# Altium project BCM_ECU.PrjPcb (part 2 of 3)

## Sheet MOSFET_BANK.SchDoc
size C; SheetNumber: 2; SheetTotal: 15
Used 4 times, as channels MOSFET_BANK_0, MOSFET_BANK_1, MOSFET_BANK_2, MOSFET_BANK_3. Parts and nets are listed once, with the designators drawn on the sheet.
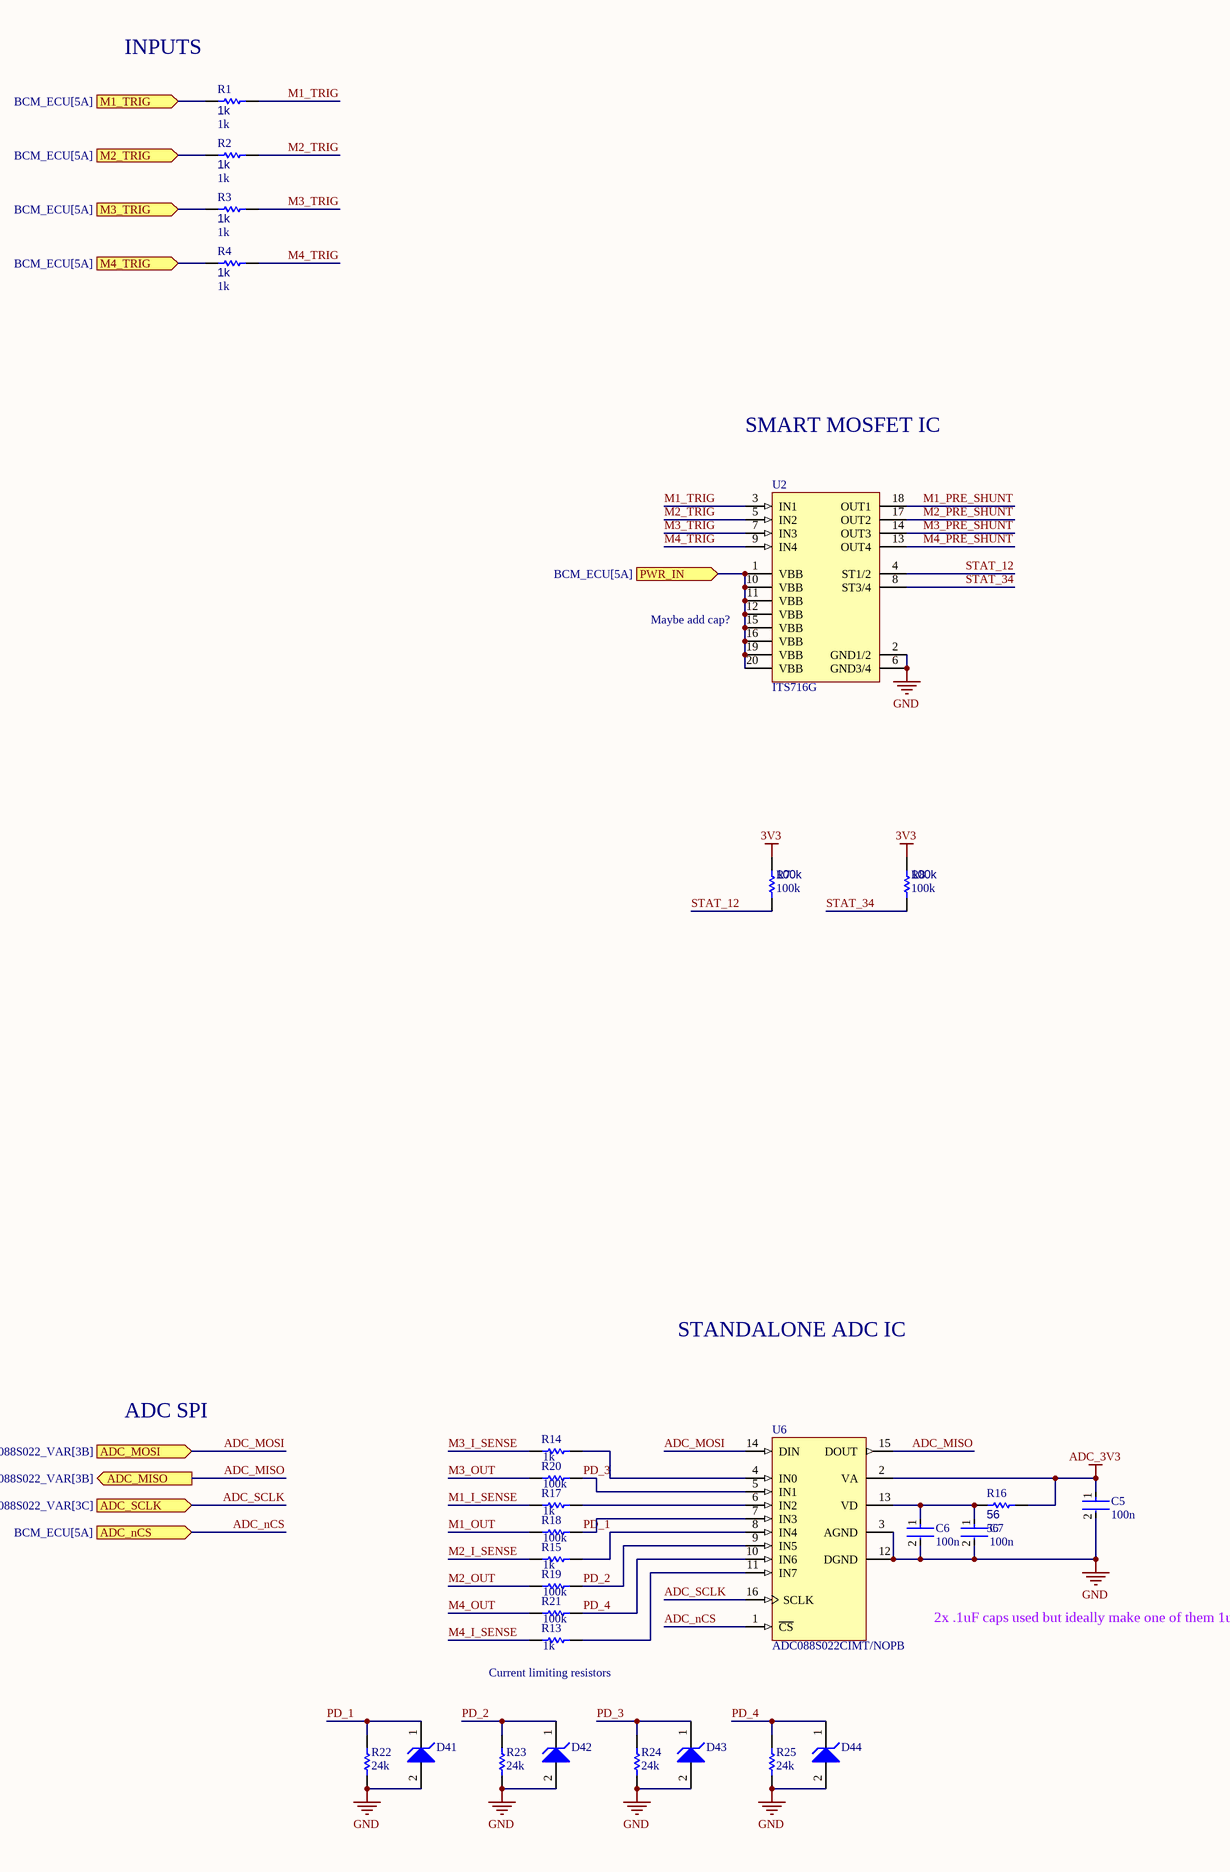
[diagram p7: MOSFET_BANK.SchDoc, left]
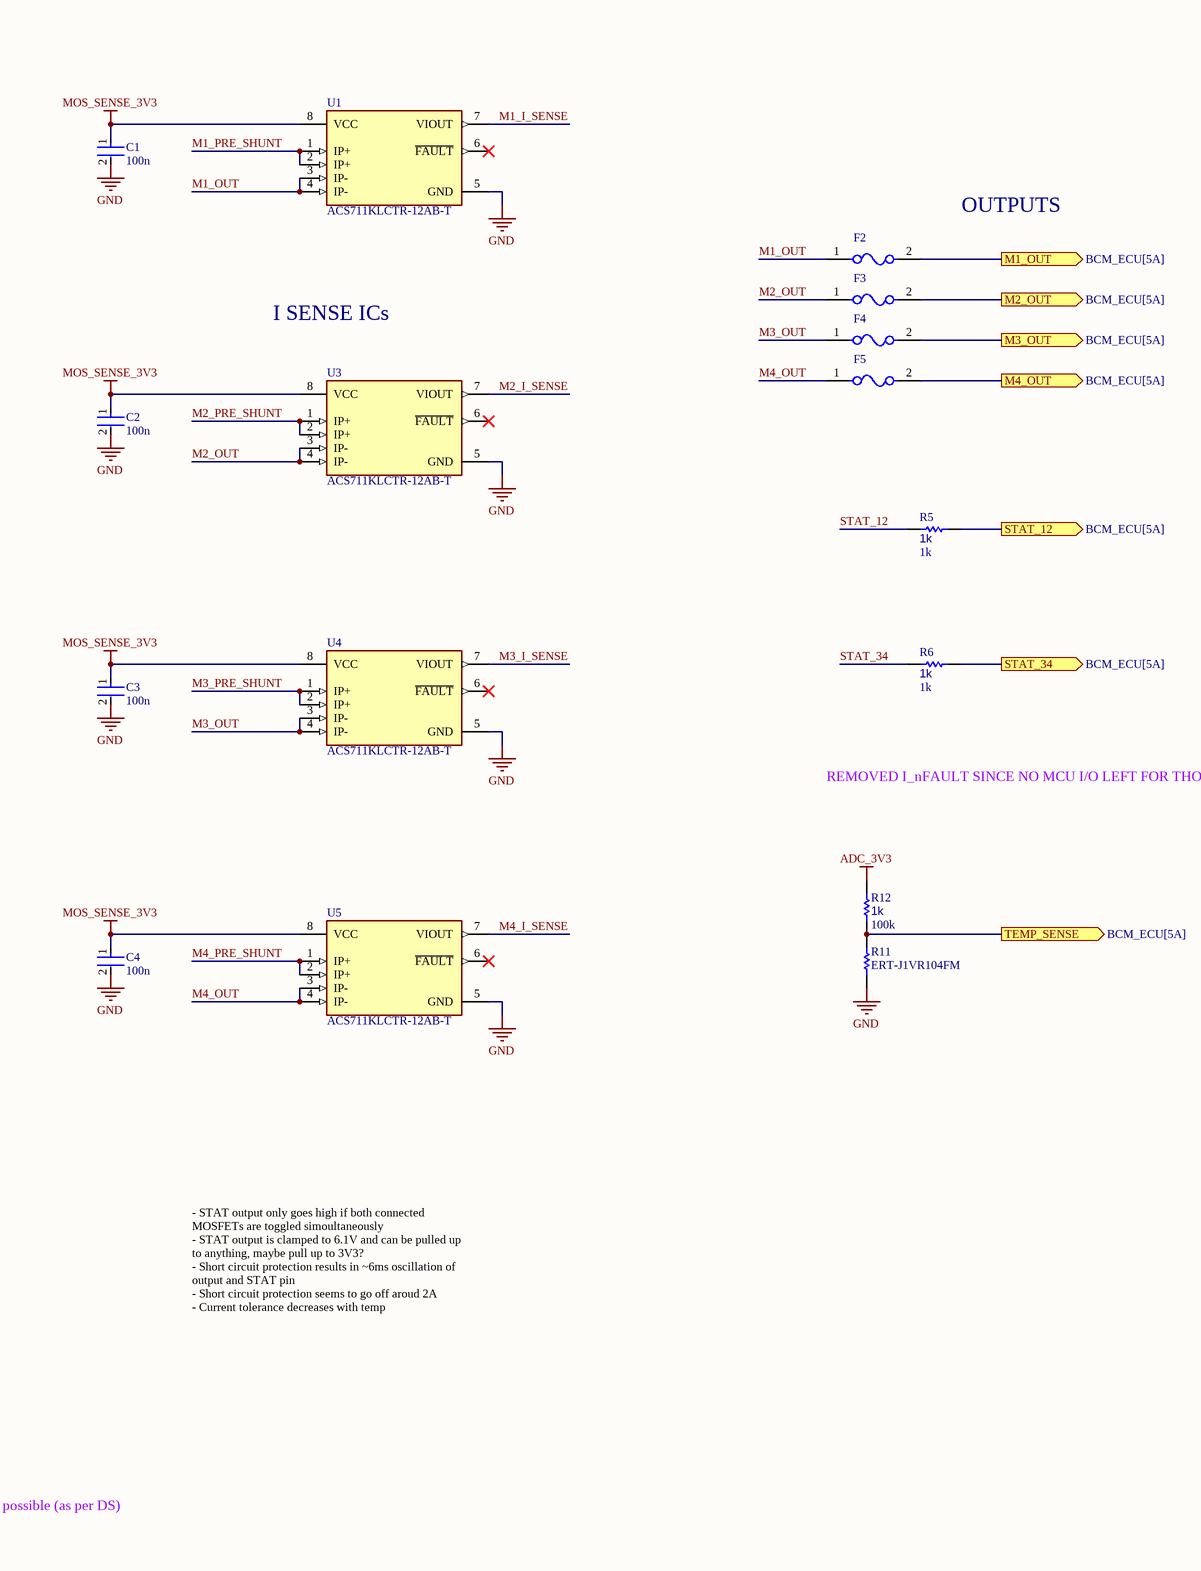
[diagram p8: MOSFET_BANK.SchDoc, right]

### Parts
C1  100n  [FP-0402-L_1_0_0_05-W_0_5-IPC_A]
C2  100n  [FP-0402-L_1_0_0_05-W_0_5-IPC_A]
C3  100n  [FP-0402-L_1_0_0_05-W_0_5-IPC_A]
C4  100n  [FP-0402-L_1_0_0_05-W_0_5-IPC_A]
C5  100n  [FP-0402-L_1_0_0_05-W_0_5-IPC_A]
C6  100n  [FP-0402-L_1_0_0_05-W_0_5-IPC_A]
C7  100n  [FP-0402-L_1_0_0_05-W_0_5-IPC_A]
D41  MM5Z3V3T1G  [ONSC-SOD-523-2-502-01_V]  (value not drawn)
D42  MM5Z3V3T1G  [ONSC-SOD-523-2-502-01_V]  (value not drawn)
D43  MM5Z3V3T1G  [ONSC-SOD-523-2-502-01_V]  (value not drawn)
D44  MM5Z3V3T1G  [ONSC-SOD-523-2-502-01_V]  (value not drawn)
F2  0466003.NR  [FP-0466-MFG]  (value not drawn)
F3  0466003.NR  [FP-0466-MFG]  (value not drawn)
F4  0466003.NR  [FP-0466-MFG]  (value not drawn)
F5  0466003.NR  [FP-0466-MFG]  (value not drawn)
R1  1k  [R0603B]
R2  1k  [R0603B]
R3  1k  [R0603B]
R4  1k  [R0603B]
R5  1k  [R0603B]
R6  1k  [R0603B]
R7  100k  [R0603B]
R8  100k  [R0603B]
R11  ERT-J1VR104FM  [RESC1608X90X30ML15T20]
R12  100k  value 1k  [R0603B]
R13  1k  [R0603B]
R14  1k  [R0603B]
R15  1k  [R0603B]
R16  56  [R0603B]
R17  1k  [R0603B]
R18  100k  [R0603B]
R19  100k  [R0603B]
R20  100k  [R0603B]
R21  100k  [R0603B]
R22  24k  [R0603B]
R23  24k  [R0603B]
R24  24k  [R0603B]
R25  24k  [R0603B]
U1  ACS711KLCTR-12AB-T  [FP-LC-8-IPC_C]
U2  ITS716G  [INF-PG-DSO-20-32_L]
U3  ACS711KLCTR-12AB-T  [FP-LC-8-IPC_C]
U4  ACS711KLCTR-12AB-T  [FP-LC-8-IPC_C]
U5  ACS711KLCTR-12AB-T  [FP-LC-8-IPC_C]
U6  ADC088S022CIMT/NOPB  [MTC16_L]

### Ports
ADC_MISO (out, see BCM_ECU[5A], ADC088S022[3B], ADC088S022_VAR[3B]), ADC_MOSI (in, see BCM_ECU[5A], ADC088S022[3B], ADC088S022_VAR[3B]), ADC_nCS (in, see BCM_ECU[5A]), ADC_SCLK (in, see BCM_ECU[5A], ADC088S022[3C], ADC088S022_VAR[3C]), M1_OUT (out, see BCM_ECU[5A]), M1_TRIG (in, see BCM_ECU[5A]), M2_OUT (out, see BCM_ECU[5A]), M2_TRIG (in, see BCM_ECU[5A]), M3_OUT (out, see BCM_ECU[5A]), M3_TRIG (in, see BCM_ECU[5A]), M4_OUT (out, see BCM_ECU[5A]), M4_TRIG (in, see BCM_ECU[5A]), PWR_IN (in, see BCM_ECU[5A]), STAT_12 (out, see BCM_ECU[5A]), STAT_34 (out, see BCM_ECU[5A]), TEMP_SENSE (out, see BCM_ECU[5A])

### Nets
3V3: R7.2 R8.2
ADC_3V3: C5.1 R12.1 R16.1 U6.2(VA)
GND: C1.2 C2.2 C3.2 C4.2 C5.2 C6.2 C7.2 D41.2(A) D42.2(A) D43.2(A) D44.2(A) R11.1 R22.2 R23.2 R24.2 R25.2 U1.5(GND) U2.2(GND1/2) U2.6(GND3/4) U3.5(GND) U4.5(GND) U5.5(GND) U6.3(AGND) U6.12(DGND)
MOS_SENSE_3V3: C1.1 C2.1 C3.1 C4.1 U1.8(VCC) U3.8(VCC) U4.8(VCC) U5.8(VCC)
ADC_MISO: U6.15(DOUT) ; port ADC_MISO
ADC_MOSI: U6.14(DIN) ; port ADC_MOSI
ADC_nCS: U6.1(~{CS}) ; port ADC_nCS
ADC_SCLK: U6.16(SCLK) ; port ADC_SCLK
M1_I_SENSE: R17.2 U1.7(VIOUT)
M1_OUT: F2.1 R18.2 U1.3(IP-) U1.4(IP-)
M1_OUT: F2.2 ; port M1_OUT  [a separate net that carries the same name]
M1_PRE_SHUNT: U1.1(IP+) U1.2(IP+) U2.18(OUT1)
M1_TRIG: R1.2 U2.3(IN1)
M1_TRIG: R1.1 ; port M1_TRIG  [a separate net that carries the same name]
M2_I_SENSE: R15.2 U3.7(VIOUT)
M2_OUT: F3.1 R19.2 U3.3(IP-) U3.4(IP-)
M2_OUT: F3.2 ; port M2_OUT  [a separate net that carries the same name]
M2_PRE_SHUNT: U2.17(OUT2) U3.1(IP+) U3.2(IP+)
M2_TRIG: R2.2 U2.5(IN2)
M2_TRIG: R2.1 ; port M2_TRIG  [a separate net that carries the same name]
M3_I_SENSE: R14.2 U4.7(VIOUT)
M3_OUT: F4.1 R20.2 U4.3(IP-) U4.4(IP-)
M3_OUT: F4.2 ; port M3_OUT  [a separate net that carries the same name]
M3_PRE_SHUNT: U2.14(OUT3) U4.1(IP+) U4.2(IP+)
M3_TRIG: R3.2 U2.7(IN3)
M3_TRIG: R3.1 ; port M3_TRIG  [a separate net that carries the same name]
M4_I_SENSE: R13.2 U5.7(VIOUT)
M4_OUT: F5.1 R21.2 U5.3(IP-) U5.4(IP-)
M4_OUT: F5.2 ; port M4_OUT  [a separate net that carries the same name]
M4_PRE_SHUNT: U2.13(OUT4) U5.1(IP+) U5.2(IP+)
M4_TRIG: R4.2 U2.9(IN4)
M4_TRIG: R4.1 ; port M4_TRIG  [a separate net that carries the same name]
PD_1: D41.1(K) R18.1 R22.1 U6.7(IN3)
PD_2: D42.1(K) R19.1 R23.1 U6.9(IN5)
PD_3: D43.1(K) R20.1 R24.1 U6.5(IN1)
PD_4: D44.1(K) R21.1 R25.1 U6.10(IN6)
PWR_IN: U2.1(VBB) U2.10(VBB) U2.11(VBB) U2.12(VBB) U2.15(VBB) U2.16(VBB) U2.19(VBB) U2.20(VBB) ; port PWR_IN
STAT_12: R5.2 R7.1 U2.4(ST1/2)
STAT_12: R5.1 ; port STAT_12  [a separate net that carries the same name]
STAT_34: R6.2 R8.1 U2.8(ST3/4)
STAT_34: R6.1 ; port STAT_34  [a separate net that carries the same name]
TEMP_SENSE: R11.2 R12.2 ; port TEMP_SENSE
NetC6_1: C6.1 C7.1 R16.2 U6.13(VD)
NetR13_1: R13.1 U6.11(IN7)
NetR14_1: R14.1 U6.4(IN0)
NetR15_1: R15.1 U6.8(IN4)
NetR17_1: R17.1 U6.6(IN2)

Not connected (* = marked no-connect by the designer): U1 6(~{FAULT})*; U3 6(~{FAULT})*; U4 6(~{FAULT})*; U5 6(~{FAULT})*

### Channels
MOSFET_BANK_0: designators end in _MOSFET_BANK_0; ports ADC_MISO=ADC_MISO ADC_MOSI=ADC_MOSI ADC_nCS=ADC_nCS ADC_SCLK=ADC_SCLK M1_OUT=OUT_0 M1_TRIG=NetR1_MOSFET_BANK_0_1 M2_OUT=OUT_1 M2_TRIG=NetR2_MOSFET_BANK_0_1 M3_OUT=OUT_2 M3_TRIG=NetR3_MOSFET_BANK_0_1 M4_OUT=OUT_3 M4_TRIG=NetR4_MOSFET_BANK_0_1 PWR_IN=BCM_VCC STAT_12=NetR5_MOSFET_BANK_0_1 STAT_34=NetR6_MOSFET_BANK_0_1 TEMP_SENSE=MOS_TEMP_0
MOSFET_BANK_1: designators end in _MOSFET_BANK_1; ports ADC_MISO=ADC_MISO ADC_MOSI=ADC_MOSI ADC_nCS=ADC_nCS ADC_SCLK=ADC_SCLK M1_OUT=OUT_4 M1_TRIG=NetR1_MOSFET_BANK_1_1 M2_OUT=OUT_5 M2_TRIG=NetR2_MOSFET_BANK_1_1 M3_OUT=OUT_6 M3_TRIG=NetR3_MOSFET_BANK_1_1 M4_OUT=OUT_7 M4_TRIG=NetR4_MOSFET_BANK_1_1 PWR_IN=BCM_VCC STAT_12=NetR5_MOSFET_BANK_1_1 STAT_34=NetR6_MOSFET_BANK_1_1 TEMP_SENSE=MOS_TEMP_1
MOSFET_BANK_2: designators end in _MOSFET_BANK_2; ports ADC_MISO=ADC_MISO ADC_MOSI=ADC_MOSI ADC_nCS=ADC_nCS ADC_SCLK=ADC_SCLK M1_OUT=OUT_8 M1_TRIG=NetR1_MOSFET_BANK_2_1 M2_OUT=OUT_9 M2_TRIG=NetR2_MOSFET_BANK_2_1 M3_OUT=OUT_10 M3_TRIG=NetR3_MOSFET_BANK_2_1 M4_OUT=OUT_11 M4_TRIG=NetR4_MOSFET_BANK_2_1 PWR_IN=BCM_VCC STAT_12=NetR5_MOSFET_BANK_2_1 STAT_34=NetR6_MOSFET_BANK_2_1 TEMP_SENSE=MOS_TEMP_2
MOSFET_BANK_3: designators end in _MOSFET_BANK_3; ports ADC_MISO=ADC_MISO ADC_MOSI=ADC_MOSI ADC_nCS=ADC_nCS ADC_SCLK=ADC_SCLK M1_OUT=OUT_12 M1_TRIG=NetR1_MOSFET_BANK_3_1 M2_OUT=OUT_13 M2_TRIG=NetR2_MOSFET_BANK_3_1 M3_OUT=OUT_14 M3_TRIG=NetR3_MOSFET_BANK_3_1 M4_OUT=OUT_15 M4_TRIG=NetR4_MOSFET_BANK_3_1 PWR_IN=BCM_VCC STAT_12=NetR5_MOSFET_BANK_3_1 STAT_34=NetR6_MOSFET_BANK_3_1 TEMP_SENSE=MOS_TEMP_3

### Notes on the sheet
- (near R1) INPUTS
- OUTPUTS
- SMART MOSFET IC
- I SENSE ICs
- (near U2) Maybe add cap?
- REMOVED I_nFAULT SINCE NO MCU I/O LEFT FOR THOSE SIGNALS
- STANDALONE ADC IC
- ADC SPI
- - STAT output only goes high if both connected MOSFETs are toggled simoultaneously
  - STAT output is clamped to 6.1V and can be pulled up to anything, maybe pull up to 3V3?
  - Short circuit protection results in ~6ms oscillation of output and STAT pin
  - Short circuit protection seems to go off aroud 2A
  - Current tolerance decreases with temp
- (near R13) Current limiting resistors
- 2x .1uF caps used but ideally make one of them 1uF if possible (as per DS)

### Library data of the parts
C1-C7 = CMP-001-00058-1: as C18 on sheet STM32H730_PINOUT; Min Operating Temperature: -55°C; Mounting Technology: Surface Mount; Pins: 2; Case/Package: 0402; RoHS Compliant: Yes; Max Operating Temperature: 85°C
D41-D44 = CMP-1060-00750-1: as D45 on sheet TCAN1146_PWR_MGMT; RoHS: Pb-Free; ComponentLink2Description: Datasheet; PackageReference: SOD-523-2-502-01; DatasheetVersion: Rev. 10; ComponentLink1Description: Manufacturer URL; PackageVersion: Rev. E, 09/2010; ComponentLink3URL: http://www.onsemi.com/pub_link/Collateral/502-01.PDF; ComponentLink2URL: http://www.onsemi.cn/pub_link/Collateral/MM5Z2V4T1-D.PDF; Mounting Technology: Surface Mount; PartNumber: MM5Z3V3T1G; Packing: Tape and Reel; PackageDescription: 2-Pin SOD, Body 1.2 x 0.8 mm; ComponentLink1URL: http://www.onsemi.com/; ComponentLink3Description: Package Specification
F2-F5 = CMP-08605-000054-1: FUSE BOARD MNT 3A 32VAC/VDC 1206; Manufacturer: Littelfuse; Fuse Interrupt Ac Current: 50A; Fuse Voltage Drop: 75.99mV; Max Fuse Ac Voltage: 32V; Fuse I2T: 0.576A2Sec; Resistance: 0.019Ω; Fuse Blow Speed: Fast; Value: 0.019Ω; ComponentLink2Description: Datasheet; Fuse Current: 3A; RoHS: TRUE; Mouser Description: Surface Mount Fuses 32V 3A VFA Slimline; Height: 0.66mm; Octopart: https://octopart.com/0466003.nr-littelfuse-565175; Package: 0466; Fuse Interrupt Dc Current: 50A; Manufacturer Part Number: 0466003.NR; Temperature Range Low: -55°C; ComponentLink2URL: https://www.littelfuse.com/~/media/electronics/datasheets/fuses/littelfuse_fuse_466_datasheet.pdf.pdf; Digikey Description: FUSE BOARD MNT 3A 32VAC/VDC 1206; Voltage Rating: 32V; Category: Fuse; Lead Free: Yes; Device Class L2: Fuses; Automotive: No; Max Fuse Dc Voltage: 32V; Temperature Range High: +90°C; Device Class L3: unset; Device Class L1: Circuit Protection; Temperature: -55°C to +90°C
R1-R8 R12-R17 = CMP-009-00002-14: Resistor
  R1-R6 R13-R15 R17: Value: 1k
  R7 R8: Value: 100k
  R16: Value: 56
R11 = CMP-2000-00869-1: Part Number: ERT-J1VR103J; Manufacturer: Panasonic
R18-R21 = CMP-009-00002-14: Resistor; Value: 10k
R22-R25 = CMP-009-00002-14: Resistor; Value: 2.7k
U1 U3-U5 = CMP-1557-00012-2: SENSOR CURRENT HALL 12.5A AC/DC; Number of Channels: 1; Min Supply Voltage: 3V; Sensitivity: 110mV/A; Response Time: 4.6us; Operating Supply Voltage: 3.3V; Max Supply Voltage: 5.5V; Max Supply Current: 5.5mA; Bandwidth: 100kHz; Linearity: 1%; Quiescent Current: 4mA; Accuracy: 5%; Polarity: Bidirectional; Case/Package: SOIC; Packaging: Tape and Reel; Number of Pins: 8; Width: 3.9mm; Frequency: 100kHz; -3db Bandwidth: 100kHz; REACH SVHC: No SVHC; Series: -; Height: 1.5mm; Package Quantity: 1; Min Operating Temperature: -40°C; Max Operating Temperature: 125°C; Current Sensing: 12.5A; RoHS Compliant: Yes; Length: 4.9mm
U2 = CMP-1095-00041-1: Smart High-Side Power Switch for Industrial Applications 4 Channels: 4 x 140 mOhm Status Feedback, 5.5 to 40 V Operating, -30 to 85 degC, PG-DSO-20-32, Reel, Green; Manufacturer: Infineon; Green: TRUE; Operating Voltage Range (max): 40 V; Operating Voltage Range (min): 5.5Â V; Ptot (max): 3.6Â W; Diagnostic: Digital; IL (nom)min - one channel active: 2.3Â A; RON (max) @ Tj max: 280 mOhm; RON @ 25 degC: 140 mOhm (max); IL (SC): 9 A; IL (nom)min - all channels active: 1.3Â A; toff (max): 270 us; Channels: 4; ton (max): 250 us; ComponentLink1Description: Manufacturer URL; Packing: Reel; ComponentLink3Description: Package Specification; ComponentLink1URL: http://www.infineon.com/; Halogen-free: available; Mounting Technology: Surface Mount; PartNumber: ITS716G; ComponentLink3URL: http://www.infineon.com/dgdl/BTS+4130QGA_DS10+_neu.pdf?folderId=db3a304314dca389011537739e37155f&fileId=db3a30431a5c32f2011a957932285680&sId=db3a30433d68e984013d7f42d6576278; PackageVersion: Mar-08; ComponentLink2Description: Datasheet; ComponentLink2URL: http://www.infineon.com/dgdl/ITS716G_DS11_20081002.pdf?folderId=db3a304412b407950112b408e8c90004&fileId=db3a304412b407950112b428c2cf3e6d; DatasheetVersion: Rev. 1.1; PackageDescription: 20-Pin Plastic (Green) Dual Small Outline Package, 12.7 x 7.5 mm Body, 1.27 mm Pitch; Load Current (typ): 1.3Â A; PackageReference: PG-DSO-20-32; IL (SCp): 9 A
U6 = CMP-0054-00372-2: 8-Channel, 50 kSPS to 200 kSPS, 8-Bit A/D Converter, 16-pin TSSOP, Pb-Free; Manufacturer: National Semiconductor; PackageTopMarking: NSUZXYTT*88S022*CIMT; CompType: ADC IC; PowerWise: Y; ComponentLink2URL: http://www.national.com/pf/AD/ADC088S022.html; RoHS: Y; PackageDescription: Molded TSSOP, Jedec, 5 x 4.4 x 0.9mm Body, 16 Lead, 0.65mm Pitch; DatasheetVersion: Feb-2010; PinCount: 16; ComponentLink1Description: ADC088S022 Datasheet; Code_JEDEC: MO-153-AB; ComponentLink3URL: http://www.national.com/packaging/folders/mtc16.html; PackageVersion: revD, Jun-2003; ComponentLink3Description: MTC16 Package Page; RevisionNote: Component URLs added; ComponentLink1URL: http://www.national.com/ds/AD/ADC088S022.pdf; ComponentLink2Description: ADC088S022 Web Page; PackageReference: MTC16

## Sheet ADC088S022.SchDoc
size A4; SheetNumber: 7; SheetTotal: 15
Used 2 times, as channels ADC_0, ADC_1. Parts and nets are listed once, with the designators drawn on the sheet.
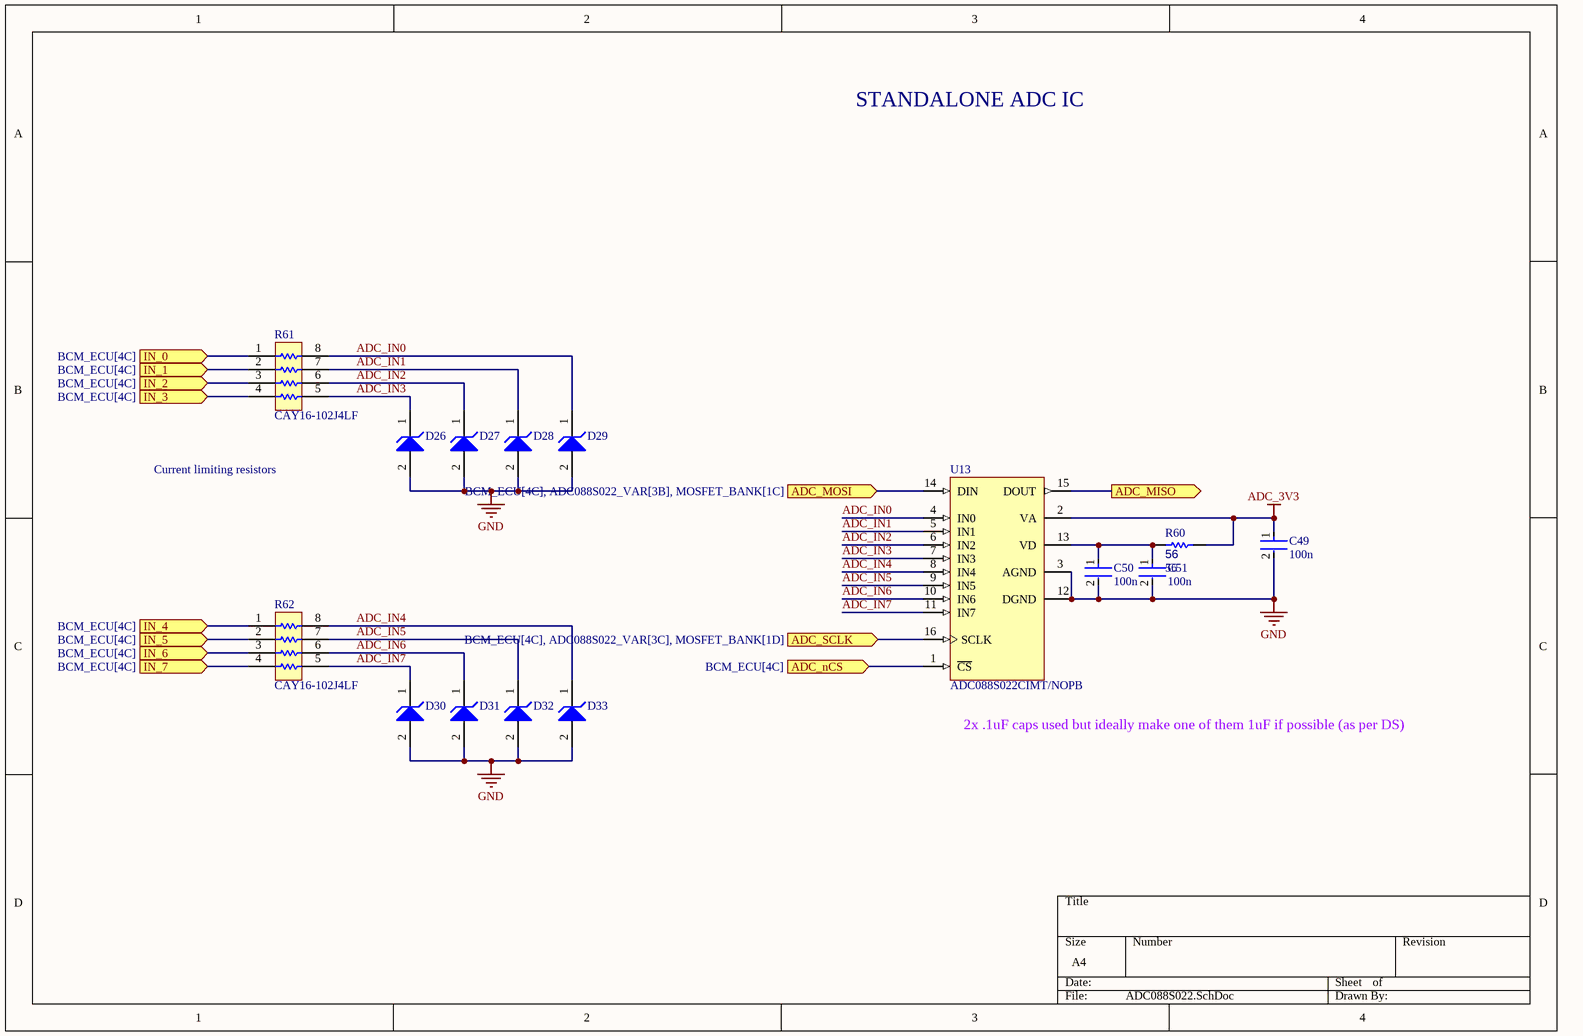
[diagram p9: ADC088S022.SchDoc]

### Parts
C49  100n  [FP-0402-L_1_0_0_05-W_0_5-IPC_A]
C50  100n  [FP-0402-L_1_0_0_05-W_0_5-IPC_A]
C51  100n  [FP-0402-L_1_0_0_05-W_0_5-IPC_A]
D26  MM5Z3V3T1G  [ONSC-SOD-523-2-502-01_V]  (value not drawn)
D27  MM5Z3V3T1G  [ONSC-SOD-523-2-502-01_V]  (value not drawn)
D28  MM5Z3V3T1G  [ONSC-SOD-523-2-502-01_V]  (value not drawn)
D29  MM5Z3V3T1G  [ONSC-SOD-523-2-502-01_V]  (value not drawn)
D30  MM5Z3V3T1G  [ONSC-SOD-523-2-502-01_V]  (value not drawn)
D31  MM5Z3V3T1G  [ONSC-SOD-523-2-502-01_V]  (value not drawn)
D32  MM5Z3V3T1G  [ONSC-SOD-523-2-502-01_V]  (value not drawn)
D33  MM5Z3V3T1G  [ONSC-SOD-523-2-502-01_V]  (value not drawn)
R60  56  [R0603B]
R61  CAY16-102J4LF  [BOUR-CAY16-J4_V]
R62  CAY16-102J4LF  [BOUR-CAY16-J4_V]
U13  ADC088S022CIMT/NOPB  [MTC16_L]

### Ports
ADC_MISO (out, see BCM_ECU[4C], ADC088S022_VAR[3B], MOSFET_BANK[1C]), ADC_MOSI (in, see BCM_ECU[4C], ADC088S022_VAR[3B], MOSFET_BANK[1C]), ADC_nCS (in, see BCM_ECU[4C]), ADC_SCLK (in, see BCM_ECU[4C], ADC088S022_VAR[3C], MOSFET_BANK[1D]), IN_0 (in, see BCM_ECU[4C]), IN_1 (in, see BCM_ECU[4C]), IN_2 (in, see BCM_ECU[4C]), IN_3 (in, see BCM_ECU[4C]), IN_4 (in, see BCM_ECU[4C]), IN_5 (in, see BCM_ECU[4C]), IN_6 (in, see BCM_ECU[4C]), IN_7 (in, see BCM_ECU[4C])

### Nets
ADC_3V3: C49.1 R60.1 U13.2(VA)
GND: C49.2 C50.2 C51.2 D26.2(A) D27.2(A) D28.2(A) D29.2(A) D30.2(A) D31.2(A) D32.2(A) D33.2(A) U13.3(AGND) U13.12(DGND)
ADC_IN0: D29.1(K) R61.8 U13.4(IN0)
ADC_IN1: D28.1(K) R61.7 U13.5(IN1)
ADC_IN2: D27.1(K) R61.6 U13.6(IN2)
ADC_IN3: D26.1(K) R61.5 U13.7(IN3)
ADC_IN4: D33.1(K) R62.8 U13.8(IN4)
ADC_IN5: D32.1(K) R62.7 U13.9(IN5)
ADC_IN6: D31.1(K) R62.6 U13.10(IN6)
ADC_IN7: D30.1(K) R62.5 U13.11(IN7)
ADC_MISO: U13.15(DOUT) ; port ADC_MISO
ADC_MOSI: U13.14(DIN) ; port ADC_MOSI
ADC_nCS: U13.1(~{CS}) ; port ADC_nCS
ADC_SCLK: U13.16(SCLK) ; port ADC_SCLK
IN_0: R61.1 ; port IN_0
IN_1: R61.2 ; port IN_1
IN_2: R61.3 ; port IN_2
IN_3: R61.4 ; port IN_3
IN_4: R62.1 ; port IN_4
IN_5: R62.2 ; port IN_5
IN_6: R62.3 ; port IN_6
IN_7: R62.4 ; port IN_7
NetC50_1: C50.1 C51.1 R60.2 U13.13(VD)

### Channels
ADC_0: designators end in _ADC_0; ports ADC_MISO=ADC_MISO ADC_MOSI=ADC_MOSI ADC_nCS=NetU10_55 ADC_SCLK=ADC_SCLK IN_0=LED_B_I_SENSE IN_1=LED_B_V_SENSE IN_2=LED_C_I_SENSE IN_3=LED_C_V_SENSE IN_4=LED_D_V_SENSE IN_5=LED_D_I_SENSE IN_6=BST_I_SENSE IN_7=BST_V_SENSE
ADC_1: designators end in _ADC_1; ports ADC_MISO=ADC_MISO ADC_MOSI=ADC_MOSI ADC_nCS=NetU10_58 ADC_SCLK=ADC_SCLK IN_0=LED_A_V_SENSE IN_1=LED_A_I_SENSE IN_2=MAIN_I_SENSE IN_3=MAIN_V_SENSE IN_4=BCM_I_SENSE IN_5=BCM_V_SENSE IN_6=AMP_V_SENSE IN_7=AMP_I_SENSE

### Notes on the sheet
- STANDALONE ADC IC
- Current limiting resistors
- (near U13) 2x .1uF caps used but ideally make one of them 1uF if possible (as per DS)

### Library data of the parts
C49-C51 = CMP-001-00058-1: as C18 on sheet STM32H730_PINOUT; Min Operating Temperature: -55°C; Mounting Technology: Surface Mount; Pins: 2; Case/Package: 0402; RoHS Compliant: Yes; Max Operating Temperature: 85°C
D26-D33 = CMP-1060-00750-1: as D45 on sheet TCAN1146_PWR_MGMT; RoHS: Pb-Free; ComponentLink2Description: Datasheet; PackageReference: SOD-523-2-502-01; DatasheetVersion: Rev. 10; ComponentLink1Description: Manufacturer URL; PackageVersion: Rev. E, 09/2010; ComponentLink3URL: http://www.onsemi.com/pub_link/Collateral/502-01.PDF; ComponentLink2URL: http://www.onsemi.cn/pub_link/Collateral/MM5Z2V4T1-D.PDF; Mounting Technology: Surface Mount; PartNumber: MM5Z3V3T1G; Packing: Tape and Reel; PackageDescription: 2-Pin SOD, Body 1.2 x 0.8 mm; ComponentLink1URL: http://www.onsemi.com/; ComponentLink3Description: Package Specification
R60 = CMP-009-00002-14: Resistor; Value: 56
R61 R62 = CMP-1747-00007-1: Chip Resistor Array, 1 KOhm, +/- 5%, 62.5 mW, -55 to 125 degC, 8-Pin SMD, RoHS, Tape and Reel; Power Rating: 100 mW; Tolerance: 1%; Voltage Rating (DC): 50 V; Resistance: 330 Ohm; Case\Package: 0603; RoHSCompliant: true; Case Code (Metric): 1608; Pins: 2; PackageDescription: 8-Pin Surface Mount Device, Body 1.6 x 3.2 mm, Pitch 0.8 mm; Height: 0.45 mm; Min Operating Temperature: -55 degC; ComponentLink1URL: http://www.bourns.com/; Case Code (Imperial): 0603; Packaging: Tape and Reel; PackageReference: CAY16-J4; ComponentLink1Description: Manufacturer URL; ComponentLink2Description: Datasheet; Length: 1.6 mm; Width: 0.8 mm; Max Operating Temperature: 155 degC; Mount: Surface Mount; DatasheetVersion: Sep-14; Voltage Rating: 50 V; REACH SVHC: No SVHC; ComponentLink2URL: http://www.bourns.com/pdfs/CATCAY.pdf; Package Quantity: 5000
U13 = CMP-0054-00372-2: as U6 on sheet MOSFET_BANK; ComponentLink2URL: http://www.national.com/pf/AD/ADC088S022.html; RoHS: Y; PackageDescription: Molded TSSOP, Jedec, 5 x 4.4 x 0.9mm Body, 16 Lead, 0.65mm Pitch; DatasheetVersion: Feb-2010; PinCount: 16; ComponentLink1Description: ADC088S022 Datasheet; Code_JEDEC: MO-153-AB; ComponentLink3URL: http://www.national.com/packaging/folders/mtc16.html; PackageVersion: revD, Jun-2003; ComponentLink3Description: MTC16 Package Page; RevisionNote: Component URLs added; ComponentLink1URL: http://www.national.com/ds/AD/ADC088S022.pdf; ComponentLink2Description: ADC088S022 Web Page; PackageReference: MTC16

## Sheet BYPASS_BLOCK.SchDoc
size A4; SheetNumber: 6; SheetTotal: 15
Used 4 times, as channels BYPASS_0, BYPASS_1, BYPASS_2, BYPASS_3. Parts and nets are listed once, with the designators drawn on the sheet.
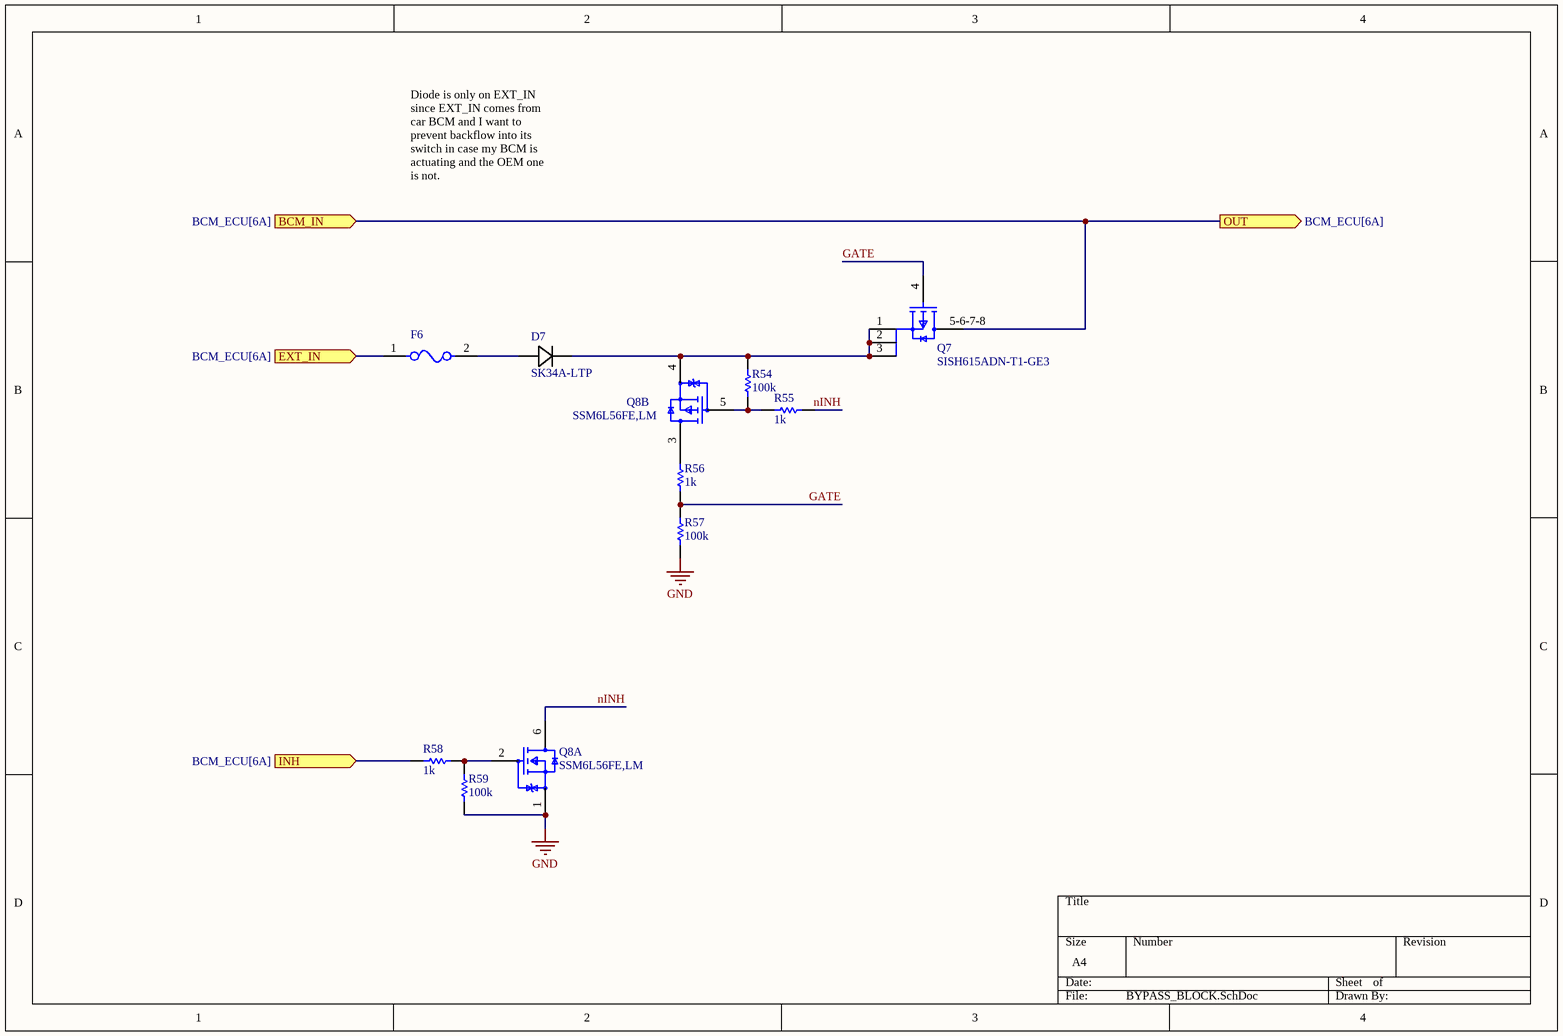
[diagram p10: BYPASS_BLOCK.SchDoc]

### Parts
D7  SK34A-LTP  [SK34A-LTP-Footprint-1]
F6  0466003.NR  [FP-0466-MFG]  (value not drawn)
Q7  SISH615ADN-T1-GE3  [SISH615ADN-T1-GE3-Footprint-1]
Q8  SSM6L56FE,LM  [FP-SON6-P-0_50-MFG]  (parts A,B of 2)
R54  100k  [R0603B]
R55  1k  [R0603B]
R56  1k  [R0603B]
R57  100k  [R0603B]
R58  1k  [R0603B]
R59  100k  [R0603B]

### Ports
BCM_IN (in, see BCM_ECU[6A]), EXT_IN (in, see BCM_ECU[6A]), INH (in, see BCM_ECU[6A]), OUT (out, see BCM_ECU[6A])

### Nets
GND: Q8.1(Source_1) R57.2 R59.1
BCM_IN: Q7.5-6-7-8(D) ; port OUT, port BCM_IN
EXT_IN: F6.1 ; port EXT_IN
GATE: Q7.4(G) R56.2 R57.1
INH: R58.2 ; port INH
nINH: Q8.6(Drain_1) R55.2
NetD7_1: D7.1(CATHODE) Q7.1(S) Q7.2(S) Q7.3(S) Q8.4(Source_2) R54.1
NetD7_2: D7.2(ANODE) F6.2
NetQ8_2: Q8.2(Gate_1) R58.1 R59.2
NetQ8_3: Q8.3(Drain_2) R56.1
NetQ8_5: Q8.5(Gate_2) R54.2 R55.1

### Channels
BYPASS_0: designators end in _BYPASS_0; ports BCM_IN=OUT_0 EXT_IN=EXT_IN_0 INH=INH_EXT_0 OUT=OUT_0
BYPASS_1: designators end in _BYPASS_1; ports BCM_IN=OUT_1 EXT_IN=EXT_IN_1 INH=INH_EXT_1 OUT=OUT_1
BYPASS_2: designators end in _BYPASS_2; ports BCM_IN=OUT_2 EXT_IN=EXT_IN_2 INH=INH_EXT_2 OUT=OUT_2
BYPASS_3: designators end in _BYPASS_3; ports BCM_IN=OUT_3 EXT_IN=EXT_IN_3 INH=INH_EXT_3 OUT=OUT_3

### Notes on the sheet
- Diode is only on EXT_IN since EXT_IN comes from car BCM and I want to prevent backflow into its switch in case my BCM is actuating and the OEM one is not.

### Library data of the parts
D7 = CMP-004-00058-2: Rectifier Diode, Schottky, 1 Phase, 1 Element, 3A, 40V V(RRM), Silicon, DO-214AC; Forward Voltage: 500mV; Max Operating Temperature: 125°C; Pins: 2; RoHS Compliant: Yes
F6 = CMP-08605-000054-1: as F2 on sheet MOSFET_BANK; ComponentLink2Description: Datasheet; Fuse Current: 3A; RoHS: TRUE; Mouser Description: Surface Mount Fuses 32V 3A VFA Slimline; Height: 0.66mm; Octopart: https://octopart.com/0466003.nr-littelfuse-565175; Package: 0466; Fuse Interrupt Dc Current: 50A; Manufacturer Part Number: 0466003.NR; Temperature Range Low: -55°C; ComponentLink2URL: https://www.littelfuse.com/~/media/electronics/datasheets/fuses/littelfuse_fuse_466_datasheet.pdf.pdf; Digikey Description: FUSE BOARD MNT 3A 32VAC/VDC 1206; Voltage Rating: 32V; Category: Fuse; Lead Free: Yes; Device Class L2: Fuses; Automotive: No; Max Fuse Dc Voltage: 32V; Temperature Range High: +90°C; Device Class L3: unset; Device Class L1: Circuit Protection; Temperature: -55°C to +90°C
Q7 = CMP-013-00018-2: Trans MOSFET P-CH 20V 22.1A 8-Pin PowerPAK 1212 EP T/R; Source: SISH615ADN-T1-GE3.SchLib; Design Item ID: CMP-013-00036-4; Component Type: Standard; Pins: 5
Q8 = CMP-35916-000023-1: SMALL-SIGNAL MOSFET 2 IN 1 NCH +
R54-R59 = CMP-009-00002-14: Resistor
  R54 R57 R59: Value: 100k
  R55 R56 R58: Value: 1k

## Sheet BOOST_REG.SchDoc
size C; SheetNumber: 9; SheetTotal: 15
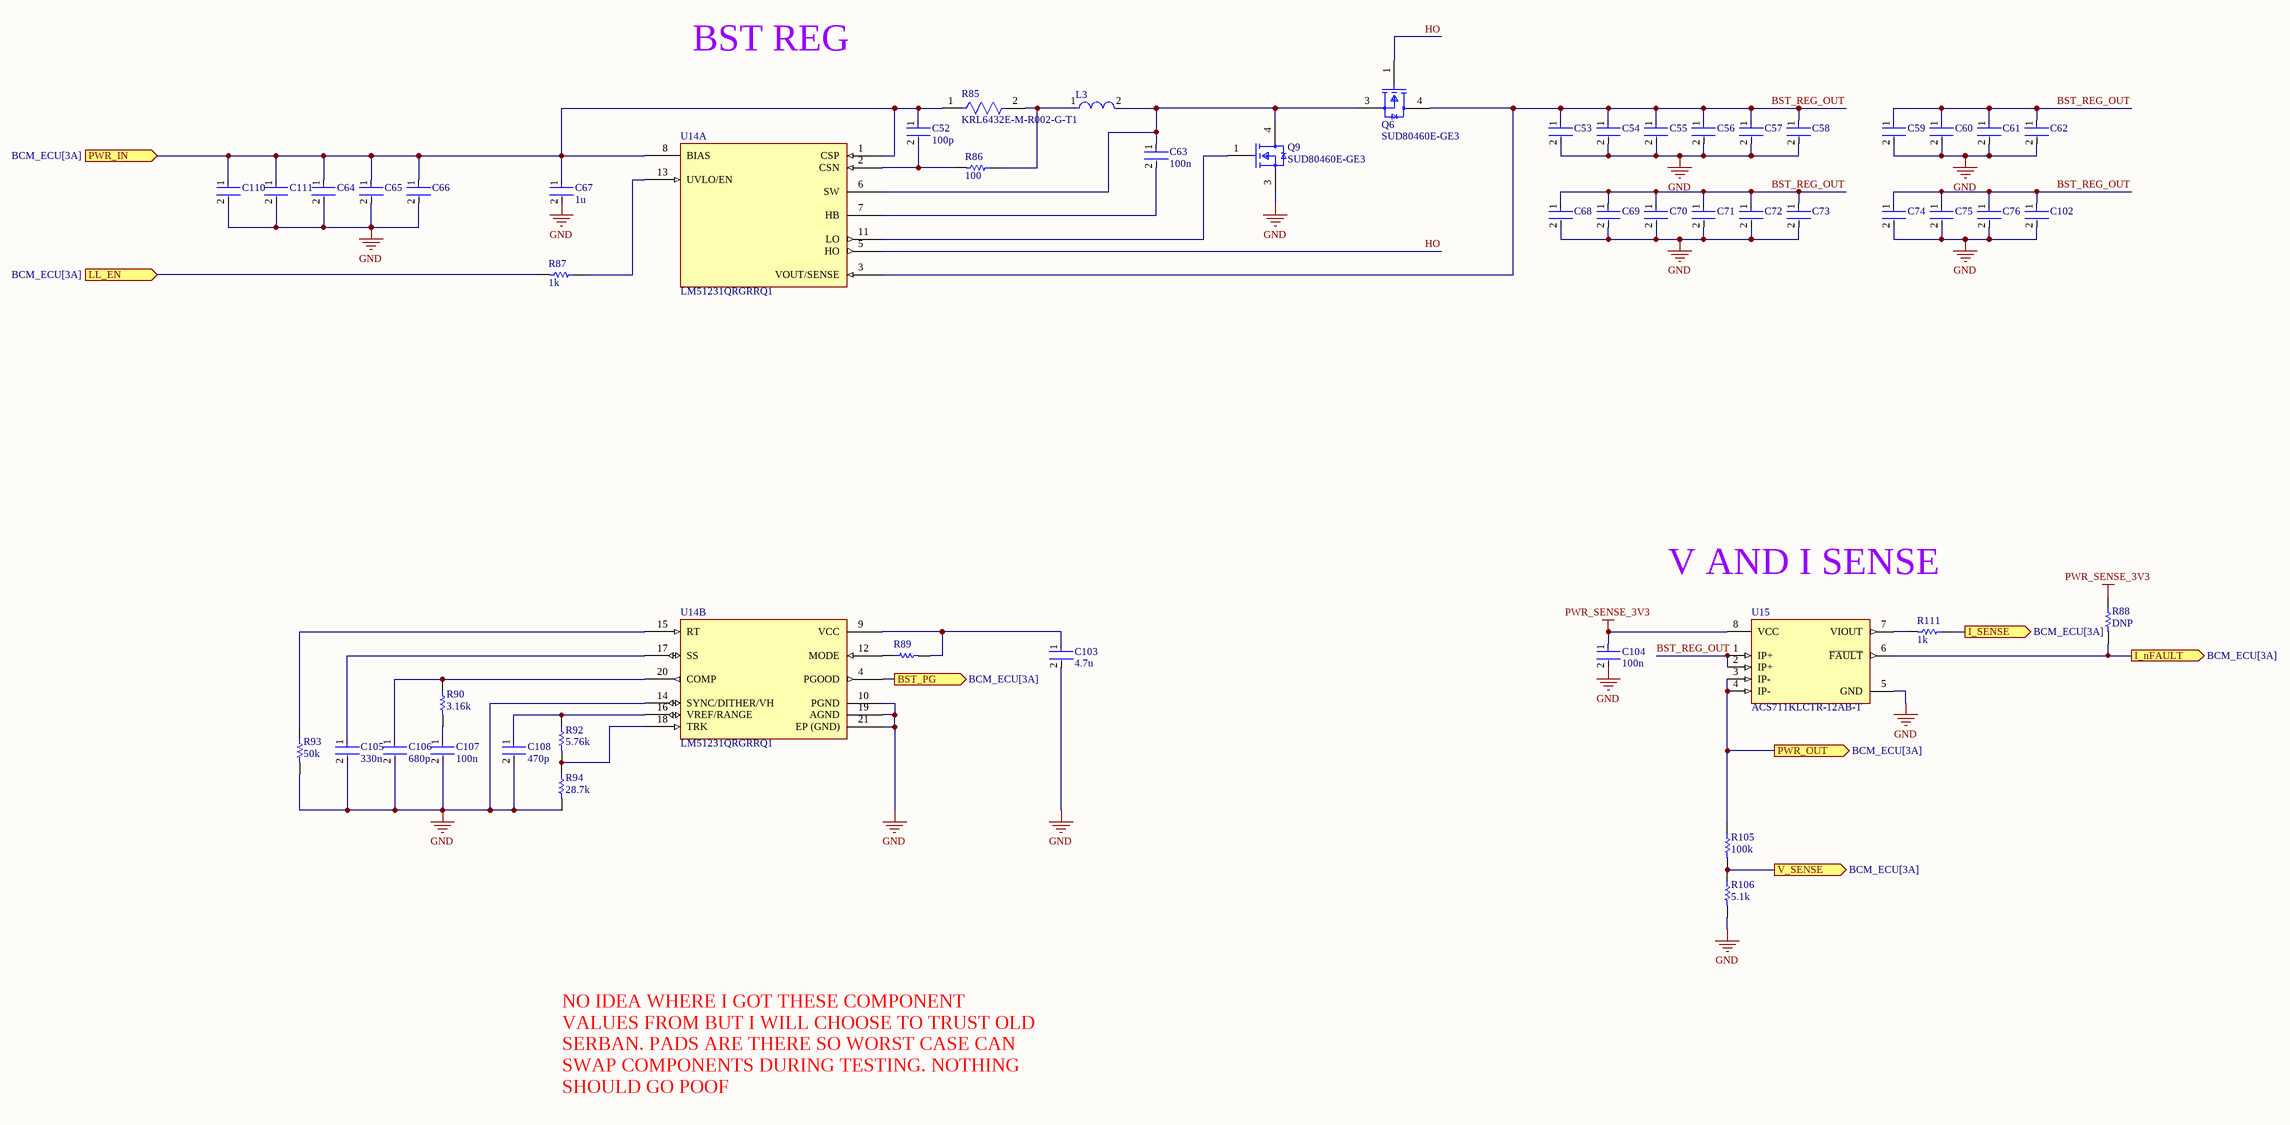
[diagram p11: BOOST_REG.SchDoc]

### Parts
C52  100p  [FP-0402-L_1_0_0_05-W_0_5-IPC_A]
C53  CGA9P3X7S2A156M250KB  [FP-CGA9P-IPC_B]  (value not drawn)
C54  CGA9P3X7S2A156M250KB  [FP-CGA9P-IPC_B]  (value not drawn)
C55  CGA9P3X7S2A156M250KB  [FP-CGA9P-IPC_B]  (value not drawn)
C56  CGA9P3X7S2A156M250KB  [FP-CGA9P-IPC_B]  (value not drawn)
C57  CGA9P3X7S2A156M250KB  [FP-CGA9P-IPC_B]  (value not drawn)
C58  CGA9P3X7S2A156M250KB  [FP-CGA9P-IPC_B]  (value not drawn)
C59  C5750X7R2A335K230KA  [FP-C5750-230-0_4-MFG]  (value not drawn)
C60  C5750X7R2A335K230KA  [FP-C5750-230-0_4-MFG]  (value not drawn)
C61  C5750X7R2A335K230KA  [FP-C5750-230-0_4-MFG]  (value not drawn)
C62  C5750X7R2A335K230KA  [FP-C5750-230-0_4-MFG]  (value not drawn)
C63  100n  [FP-0402-L_1_0_0_05-W_0_5-IPC_A]
C64  CKG57NX5R1H226M500JH  [FP-CKG57N-MFG]  (value not drawn)
C65  CKG57NX5R1H226M500JH  [FP-CKG57N-MFG]  (value not drawn)
C66  HMK325B7105KN-T  [FP-1210-L_3_2_0_3-W_2_5_0-IPC_B]  (value not drawn)
C67  1u  [FP-0402-L_1_0_0_05-W_0_5-IPC_A]
C68  CGA9P3X7S2A156M250KB  [FP-CGA9P-IPC_B]  (value not drawn)
C69  CGA9P3X7S2A156M250KB  [FP-CGA9P-IPC_B]  (value not drawn)
C70  CGA9P3X7S2A156M250KB  [FP-CGA9P-IPC_B]  (value not drawn)
C71  CGA9P3X7S2A156M250KB  [FP-CGA9P-IPC_B]  (value not drawn)
C72  CGA9P3X7S2A156M250KB  [FP-CGA9P-IPC_B]  (value not drawn)
C73  CGA9P3X7S2A156M250KB  [FP-CGA9P-IPC_B]  (value not drawn)
C74  C5750X7R2A335K230KA  [FP-C5750-230-0_4-MFG]  (value not drawn)
C75  C5750X7R2A335K230KA  [FP-C5750-230-0_4-MFG]  (value not drawn)
C76  C5750X7R2A335K230KA  [FP-C5750-230-0_4-MFG]  (value not drawn)
C102  C5750X7R2A335K230KA  [FP-C5750-230-0_4-MFG]  (value not drawn)
C103  4.7u  [FP-0402-L_1_0_0_05-W_0_5-IPC_A]
C104  100n  [FP-0402-L_1_0_0_05-W_0_5-IPC_A]
C105  330n  [FP-0402-L_1_0_0_05-W_0_5-IPC_A]
C106  680p  [FP-0402-L_1_0_0_05-W_0_5-IPC_A]
C107  100n  [FP-0402-L_1_0_0_05-W_0_5-IPC_A]
C108  470p  [FP-0402-L_1_0_0_05-W_0_5-IPC_A]
C110  DNP  [FP-CKG57N-MFG]  (value not drawn)
C111  DNP  [FP-CKG57N-MFG]  (value not drawn)
L3  PM5433.302NLT  [PM5433.302NLT-Footprint-1]  (value not drawn)
Q6  SUD80460E-GE3  [FP-T16-0236-MFG]
Q9  SUD80460E-GE3  [FP-T16-0236-MFG]
R85  KRL6432E-M-R002-G-T1  [FP-KRL6432E-MFG]
R86  100  [R0603B]
R87  1k  [R0603B]
R88  DNP  [R0603B]
R89  0402 JUMPER  [RESC1005X40X25ML05T05]  (value not drawn)
R90  3.16k  [R0603B]
R92  5.76k  [R0603B]
R93  50k  [R0603B]
R94  28.7k  [R0603B]
R105  100k  [R0603B]
R106  5.1k  [R0603B]
R111  1k  [R0603B]
U14  LM51231QRGRRQ1  [QFN50P350X350X100_HS-21N]  (parts A,B of 2)
U15  ACS711KLCTR-12AB-T  [FP-LC-8-IPC_C]

### Ports
BST_PG (out, see BCM_ECU[3A]), I_nFAULT (out, see BCM_ECU[3A]), I_SENSE (out, see BCM_ECU[3A]), LL_EN (in, see BCM_ECU[3A]), PWR_IN (in, see BCM_ECU[3A]), PWR_OUT (out, see BCM_ECU[3A]), V_SENSE (out, see BCM_ECU[3A])

### Nets
GND: C53.2 C54.2 C55.2 C56.2 C57.2 C58.2 C59.2 C60.2 C61.2 C62.2 C64.2 C65.2 C66.2 C67.2 C68.2 C69.2 C70.2 C71.2 C72.2 C73.2 C74.2 C75.2 C76.2 C102.2 C103.2 C104.2 C105.2 C106.2 C107.2 C108.2 C110.2 C111.2 Q9.3(S) R93.2 R94.2 R106.2 U14.10(PGND) U14.14(SYNC/DITHER/VH) U14.19(AGND) U14.21(EP_(GND)) U15.5(GND)
PRE_BST_AMP_VCC: C52.1 C64.1 C65.1 C66.1 C67.1 C110.1 C111.1 R85.1 U14.1(CSP) U14.8(BIAS) ; port PWR_IN
PWR_SENSE_3V3: C104.1 R88.1 U15.8(VCC)
AMP_VCC: R105.1 U15.3(IP-) U15.4(IP-) ; port PWR_OUT
BST_I_SENSE: R111.1 ; port I_SENSE
BST_REG_OUT: C53.1 C54.1 C55.1 C56.1 C57.1 C58.1 C59.1 C60.1 C61.1 C62.1 C68.1 C69.1 C70.1 C71.1 C72.1 C73.1 C74.1 C75.1 C76.1 C102.1 Q6.4(D) U14.3(VOUT/SENSE) U15.1(IP+) U15.2(IP+)
BST_V_SENSE: R105.2 R106.1 ; port V_SENSE
HO: Q6.1(G) U14.5(HO)
NetC52_2: C52.2 R86.2 U14.2(CSN)
NetC63_1: C63.1 L3.2 Q6.3(S) Q9.4(D) U14.6(SW)
NetC63_2: C63.2 U14.7(HB)
NetC103_1: C103.1 R89.2 U14.9(VCC)
NetC105_1: C105.1 U14.17(SS)
NetC106_1: C106.1 R90.1 U14.20(COMP)
NetC107_1: C107.1 R90.2
NetC108_1: C108.1 R92.1 U14.16(VREF/RANGE)
NetL3_1: L3.1 R85.2 R86.1
NetQ9_1: Q9.1(G) U14.11(LO)
NetR87_1: R87.1 U14.13(UVLO/EN)
NetR87_2: R87.2 ; port LL_EN
NetR88_2: R88.2 U15.6(~{FAULT}) ; port I_nFAULT
NetR89_1: R89.1 U14.12(MODE)
NetR92_2: R92.2 R94.1 U14.18(TRK)
NetR93_1: R93.1 U14.15(RT)
NetR111_2: R111.2 U15.7(VIOUT)
NetU14_4: U14.4(PGOOD) ; port BST_PG

### Notes on the sheet
- BST REG
- V AND I SENSE
- NO IDEA WHERE I GOT THESE COMPONENT VALUES FROM BUT I WILL CHOOSE TO TRUST OLD SERBAN. PADS ARE THERE SO WORST CASE CAN SWAP COMPONENTS DURING TESTING. NOTHING SHOULD GO POOF

### Library data of the parts
C52 C63 C67 C103-C108 = CMP-001-00058-1: LARGE PADS, 0402 CAP, CHANGE COMMENT TO MATCH REAL P/N; Capacitor Type: Ceramic; Min Operating Temperature: -55°C; Mounting Technology: Surface Mount; Pins: 2; Case/Package: 0402; RoHS Compliant: Yes; Max Operating Temperature: 85°C
C53-C58 C68-C73 = CMP-2000-07446-2: Cap Ceramic 15uF 100V X7S 20% Pad SMD 2220 +125°C Automotive T/R; Thickness: 0.098inch; Weight: 0.016932oz; Depth: 5mm; Min Operating Temperature: -55°C; Composition: Ceramic; Voltage Rating: 100V; Capacitance: 15uF; Package Quantity: 1; Width: 0.197inch; Max Operating Temperature: 125°C; Voltage Rating (DC): 100V; Case Code (Metric): 5750; Tolerance: 20%; Length: 5.7mm; Height: 2.3mm; Mount: Surface Mount; Dielectric: X7S; Termination: SMD/SMT; Case/Package: 2220; Case Code (Imperial): 2220; Packaging: Tape and Reel; Lead Free: Lead Free; Ratings: AEC-Q200; REACH SVHC: No SVHC
C59-C62 C74-C76 C102 = CMP-08246-004290-1: Multilayer Ceramic Capacitors 3.3uF ±10% 100V X7R SMD 2220; Resistor Type: Ceramic; Voltage Rating: 100V; Termination: SMD/SMT; Length: 5.7mm; Lead Free: Lead Free; Voltage: 100V; Voltage Rating (DC): 100V; Depth: 5mm; Width: 5mm; Case Code (Imperial): 2220; Tolerance: 10%; Mount: Surface Mount; Package Quantity: 1; RoHS Compliant: Yes; Thickness: 0.098inch; Min Operating Temperature: -55°C; Packaging: Tape and Reel; Case Code (Metric): 5750; Number of Pins: 2; Dielectric: X7R; Weight: 0.016932oz; Max Operating Temperature: 125°C; Capacitance: 3.3uF; Case/Package: 2220; Series: C; Height: 2.3mm
C64 C65 C110 C111 = CMP-08246-005087-1: CAP CER 22UF 50V X5R SMD; Lead/Base Style: L-Lead; Tolerance: 20%; Case Code (Imperial): 2220; Length: 6mm; Packaging: Tape and Reel; Thickness: 0.217inch; Min Operating Temperature: -55°C; Max Operating Temperature: 85°C; Voltage: 50V; Series: CKG; REACH SVHC: No SVHC; Height: 5mm; Dielectric: X5R; RoHS Compliant: Yes; Radiation Hardening: No; Capacitance: 22uF; Package Quantity: 1; Voltage Rating: 50V; Width: 5mm; Voltage Rating (DC): 50V; Number of Pins: 2; Case Code (Metric): 5750; Termination: Metal; Mount: Surface Mount; Case/Package: Ceramic; Lead Free: Lead Free; Depth: 5mm; Resistor Type: Ceramic
C66 = CMP-14477-002774-2: None; Dielectric: X5R; Capacitance: 1uF; Voltage Rating (DC): 100V; Tolerance: 10%; Length: 3.2mm; Thickness: 0.083inch; Construction: Flat; Width: 2.5mm; Number of Pins: 2; Height: 1.9mm; REACH SVHC: No SVHC; Case Code (Metric): 3225; Termination: SMD/SMT; Packaging: Tape and Reel; Resistor Type: Ceramic; Mount: Surface Mount; Radiation Hardening: No; Case/Package: 1210; Case Code (Imperial): 1210; Min Operating Temperature: -55°C; Max Operating Temperature: 125°C; Halogen Free: Halogen Free; Voltage Rating: 100V; Depth: 2.5mm; Package Quantity: 1; RoHS Compliant: Yes; Voltage: 100V; Series: M
L3 = CMP-006-00032-1: High Current Composite Inductor - PA5433.XXXNLT and PM5433.XXXNLT
Q6 Q9 = CMP-02550-000179-1: MOSFET N-CH 150V 42A TO252AA; Manufacturer: Vishay; Rthja Max: 50°C/W; Number Of N Channels: 1; Max Junction Temp: +175°C; Power Dissipation: 65.2W; Reverse Recovery Charge: 210nC; Reverse Recovery Time: 68ns; Threshold Vgs Max: 4V; Input Capacitace At Vds: 560pF @ 50V; Drain To Source Resistance: 0.0372Ω; Max Forward Diode Voltage: 1.5V; Gate Charge At Vgs: 10.5nC @ 10V; Threshold Vgs Min: 2V; Transconductance: 11S; Typ Forward Diode Voltage: 0.85V; Turn On Delay Time: 8ns; Turn Off Delay Time: 15ns; Gate To Source Voltage: 20V; Depletion Mode: False; Pulse Drain Current: 40A; Automotive: No; Drain To Source Voltage: 150V; ComponentLink2Description: Datasheet; Octopart: https://octopart.com/sud80460e-ge3-vishay-78440626; Device Class L2: Transistors; Lead Free: Yes; Device Class L3: MOSFETs; Temperature Range High: +175°C; Continuous Drain Current: 42A; Temperature: -55°C to +175°C; Footprint Url: https://www.vishay.com/docs/71197/to252aa.pdf; Manufacturer Part Number: SUD80460E-GE3; Package: T16-0236; ComponentLink2URL: https://www.vishay.com/docs/76248/sud80460e.pdf; Device Class L1: Discrete Semiconductors; Digikey Description: MOSFET N-CH 150V 42A TO252AA; Number Of Channels: 1; Category: Trans; Temperature Range Low: -55°C; Height: 2.507mm; RoHS: TRUE; Drain To Source Breakdown Voltage: 150V
R85 = CMP-00597-24927455-1: KRL6432E-M-R002-G-T1 Metal Foil Low Resistance Chip Resistor (long-side terminal), 2512, RoHS; Power Rating: 3W; Tolerance: 2%; Resistance: 2mΩ; Temperature Coefficient: 100ppm/°C; Width: 6.3mm; Termination: SMD/SMT; Weight: 40.511469mg; RoHS: Compliant; Lifecycle Status: Production; Case Code (Imperial): 2512; Case Code (Metric): 6432; Case/Package: 2512; Height: 700µm; Length: 3.1mm; Max Thickness: 700µm; Min Operating Temperature: -55°C; NexarPartId: 24927455; Composition: Metal Foil; Max Operating Temperature: 155°C
R86-R88 R90 R92-R94 R105 R106 = CMP-009-00002-14: Resistor; Value: 330
R89 = CMP-009-00118-2: READ THE NAME; Pins: 2; Component Type: Standard; Design Item ID: CMP-009-00206-2; Source: 0402jump.SchLib
R111 = CMP-009-00002-14: Resistor; Value: 1k
U14 = CMP-019-00051-1: 2.2-MHz wide-VIN, synchronous boost controller with output voltage tracking 20-VQFN -40 to 125
U15 = CMP-1557-00012-2: SENSOR CURRENT HALL 12.5A AC/DC; Number of Channels: 1; Min Supply Voltage: 3V; Sensitivity: 110mV/A; Response Time: 4.6us; Operating Supply Voltage: 3.3V; Max Supply Voltage: 5.5V; Max Supply Current: 5.5mA; Bandwidth: 100kHz; Linearity: 1%; Quiescent Current: 4mA; Accuracy: 5%; Polarity: Bidirectional; Case/Package: SOIC; Packaging: Tape and Reel; Number of Pins: 8; Width: 3.9mm; Frequency: 100kHz; -3db Bandwidth: 100kHz; REACH SVHC: No SVHC; Series: -; Height: 1.5mm; Package Quantity: 1; Min Operating Temperature: -40°C; Max Operating Temperature: 125°C; Current Sensing: 12.5A; RoHS Compliant: Yes; Length: 4.9mm

## Sheet INT_REG.SchDoc
size A4; SheetNumber: 8; SheetTotal: 15
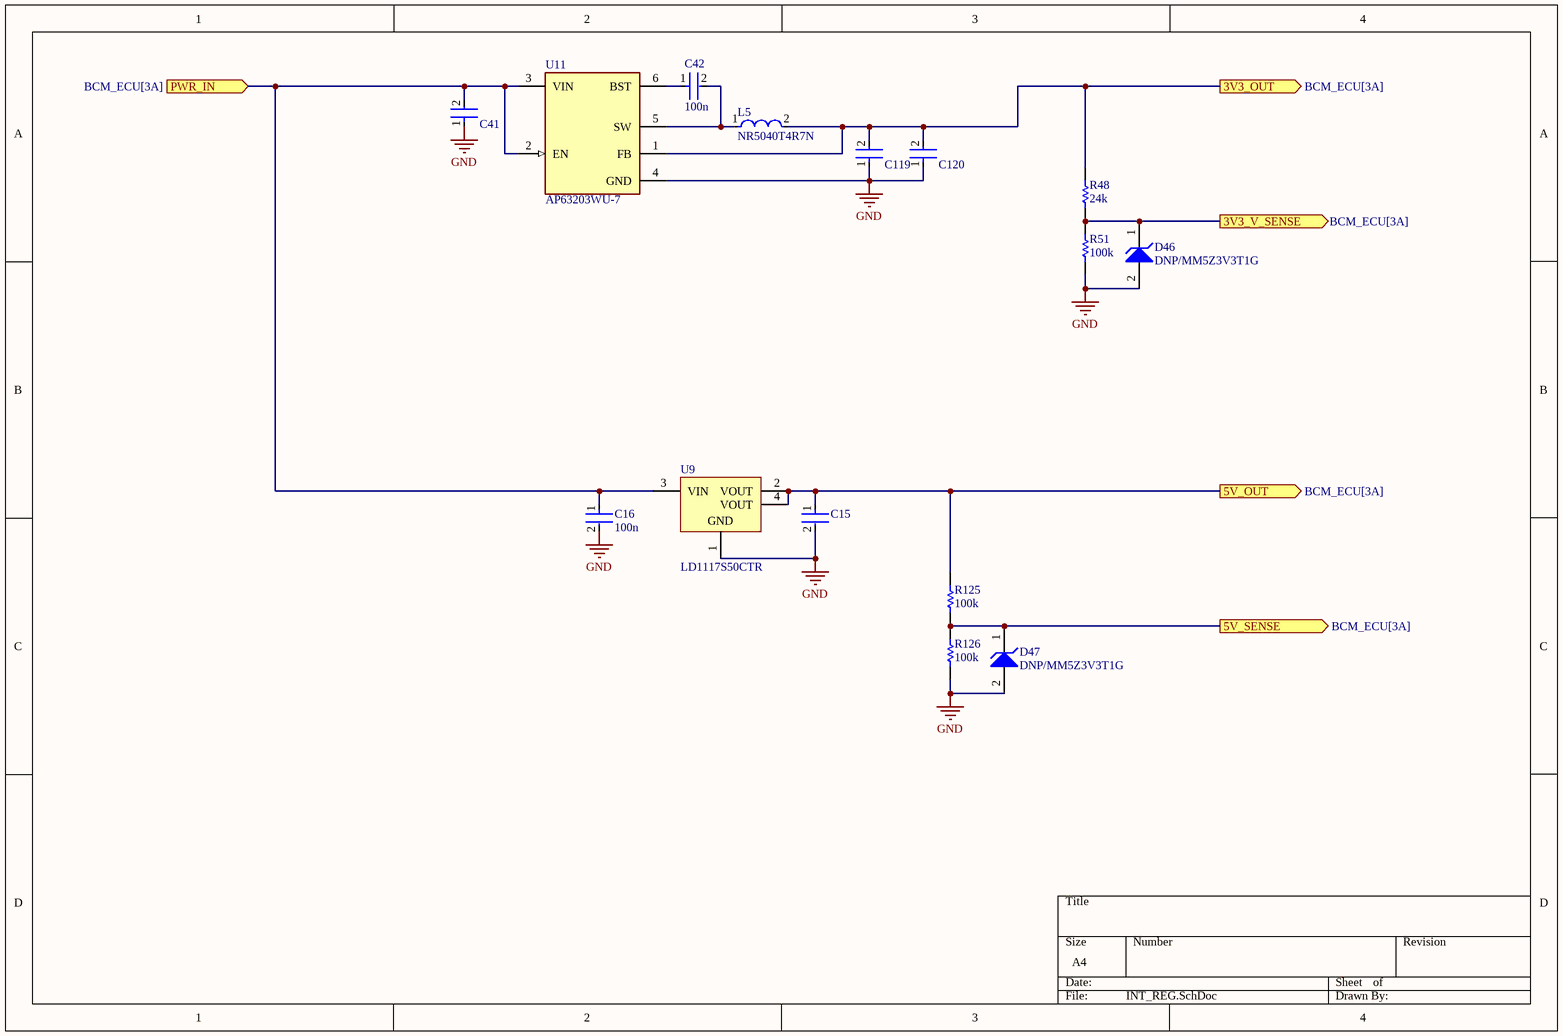
[diagram p12: INT_REG.SchDoc]

### Parts
C15  GRM188R60J106ME47D  [FP-GRM188-0_1-e0_2_0_55-IPC_A]  (value not drawn)
C16  100n  [FP-0402-L_1_0_0_05-W_0_5-IPC_A]
C41  GRM21BR61E226ME44L  [FP-GRM21B-0_2-e0_2_0_7-IPC_B]  (value not drawn)
C42  100n  [FP-0402-L_1_0_0_05-W_0_5-IPC_A]
C119  GRM21BR61E226ME44L  [FP-GRM21B-0_2-e0_2_0_7-IPC_B]  (value not drawn)
C120  GRM21BR61E226ME44L  [FP-GRM21B-0_2-e0_2_0_7-IPC_B]  (value not drawn)
D46  DNP/MM5Z3V3T1G  [ONSC-SOD-523-2-502-01_V]
D47  DNP/MM5Z3V3T1G  [ONSC-SOD-523-2-502-01_V]
L5  NR5040T4R7N  [FP-NR5040-H_4_1-MFG]
R48  24k  [R0603B]
R51  100k  [R0603B]
R125  100k  [R0603B]
R126  100k  [R0603B]
U9  LD1117S50CTR  [SOT-223_N]
U11  AP63203WU-7  [FP-TSOT26-MFG]

### Ports
3V3_OUT (out, see BCM_ECU[3A]), 3V3_V_SENSE (out, see BCM_ECU[3A]), 5V_OUT (out, see BCM_ECU[3A]), 5V_SENSE (out, see BCM_ECU[3A]), PWR_IN (in, see BCM_ECU[3A])

### Nets
3V3: C119.2 C120.2 L5.2 R48.1 U11.1(FB) ; port 3V3_OUT
5V: C15.1 R125.1 U9.2(VOUT) U9.4(VOUT) ; port 5V_OUT
GND: C15.2 C16.2 C41.1 C119.1 C120.1 D46.2(A) D47.2(A) R51.2 R126.2 U9.1(GND) U11.4(GND)
3V3_V_SENSE: D46.1(K) R48.2 R51.1 ; port 3V3_V_SENSE
5V_V_SENSE: D47.1(K) R125.2 R126.1 ; port 5V_SENSE
NetC16_1: C16.1 C41.2 U9.3(VIN) U11.2(EN) U11.3(VIN) ; port PWR_IN
NetC42_1: C42.1 U11.6(BST)
NetC42_2: C42.2 L5.1 U11.5(SW)

### Library data of the parts
C15 = CMP-2006-02792-2: Chip Multilayer Ceramic Capacitors for General Purpose, 0603, 10uF, X5R, 15%, 20%, 6.3V; Packaging: Tape and Reel; Voltage Rating (DC): 6.3V; Width: 0.031inch; Termination: SMD/SMT; Dielectric: X5R; Package Quantity: 4000; Voltage Rating: 6.3V; Capacitance: 10uF; Case/Package: 0603; Min Operating Temperature: -55°C; Voltage: 6.3V; Length: 1.6mm; Thickness: 0.035inch; Lead Free: Lead Free; Depth: 0.8mm; Case Code (Imperial): 0603; Max Operating Temperature: 85°C; Material: Ceramic; Height: 0.8mm; Tolerance: 20%; Mount: Surface Mount; REACH SVHC: No SVHC; Radiation Hardening: No; Case Code (Metric): 1608
C16 C42 = CMP-001-00058-1: as C52 on sheet BOOST_REG; Min Operating Temperature: -55°C; Mounting Technology: Surface Mount; Pins: 2; Case/Package: 0402; RoHS Compliant: Yes; Max Operating Temperature: 85°C
C41 C119 C120 = CMP-2007-03222-3: Chip Multilayer Ceramic Capacitors for General Purpose, 0805, 22uF, X5R, 15%, 20%, 25V; Case/Package: 0805; Depth: 1.25mm; Resistor Type: Ceramic; Voltage Rating: 25V; Lead Free: Lead Free; Voltage Rating (DC): 25V; Case Code (Metric): 2012; Thickness: 0.057inch; REACH SVHC: No SVHC; Material: Ceramic; Tolerance: 20%; Length: 2mm; Capacitance: 22uF; Case Code (Imperial): 0805; Max Operating Temperature: 85°C; Termination: SMD/SMT; Weight: 0.000335oz; Dielectric: X5R; Packaging: Tape and Reel; Voltage: 25V; Package Quantity: 3000; Height: 1.25mm; Mount: Surface Mount; Width: 1.25mm; Min Operating Temperature: -55°C
D46 D47 = CMP-1060-00750-1: Zener Voltage Regulator, 500 mW, 2-Pin SOD-523, Pb-Free, Tape and Reel; Manufacturer: On Semiconductor; P Max (W): 0.5; VZ Typ (V): 3.3; RoHS: Pb-Free; ComponentLink2Description: Datasheet; PackageReference: SOD-523-2-502-01; DatasheetVersion: Rev. 10; ComponentLink1Description: Manufacturer URL; PackageVersion: Rev. E, 09/2010; ComponentLink3URL: http://www.onsemi.com/pub_link/Collateral/502-01.PDF; ComponentLink2URL: http://www.onsemi.cn/pub_link/Collateral/MM5Z2V4T1-D.PDF; Mounting Technology: Surface Mount; PartNumber: MM5Z3V3T1G; Packing: Tape and Reel; PackageDescription: 2-Pin SOD, Body 1.2 x 0.8 mm; ComponentLink1URL: http://www.onsemi.com/; ComponentLink3Description: Package Specification
L5 = CMP-14484-001014-1: SMD Power Inductors 4.7uH ±30% 3.1A 37.7mΩ; Test Frequency: 100kHz; Self Resonant Frequency: 28MHz; DC Resistance (DCR): 37.7mR; Saturation Current: 3.3A; Shielding: Shielded; Core Material: Ferrite; Package Quantity: 1500; RoHS Compliant: Yes; Resistor Type: Wirewound; Width: 4.9mm; Termination: SMD/SMT; Number of Pins: 2; Current Rating: 3.1A; Depth: 5.1mm; RMS Current (Irms): 3.1A; Height - Seated (Max): 0.161inch; Height: 4mm; Packaging: Tape and Reel; Inductance: 4.7uH; Length: 0.193inch; Max DC Current: 3.3A; Inductance Tolerance: 30%; Case/Package: Nonstandard; Series: NR; Min Operating Temperature: -25°C; Max Operating Temperature: 120°C; Mount: Surface Mount; Radiation Hardening: No; Tolerance: 30%; Halogen Free: Halogen Free
R48 R51 R125 R126 = CMP-009-00002-14: Resistor
U9 = CMP-0244-00311-1: Fixed Low Drop Positive Voltage Regulator, 5V, 4-Pin SOT-223, Tape and Reel; PackageReference: SOT-223; PackageVersion: 2010; ComponentLink2URL: http://www.st.com/internet/com/TECHNICAL_RESOURCES/TECHNICAL_LITERATURE/DATASHEET/CD00000544.pdf; ComponentLink1URL: http://www.st.com; ComponentLink2Description: Datasheet; DatasheetVersion: 1/11/2011; ComponentLink1Description: Manufacturer URL; PackageDescription: 4-Pin SOT-223 Package, 6.5 x 3.5 mm Body, 2.3 mm Pitch, 7 mm Lead Span
U11 = CMP-12757-000006-1: IC REG BUCK 3.3V 2A TSOT26; Manufacturer: Diodes Inc.; Output Type: Fixed; Min Supply Voltage: 3.8V; Number Of Outputs: 1; Max Junction Temp: +160°C; Nominal Supply Current: 22uA; Standoff Height: 0.01mm; Switching Frequency: 1.1MHz; Max Supply Voltage: 32V; ComponentLink2Description: Datasheet; Device Class L1: Integrated Circuits (ICs); Temperature: to +160°C; Device Class L3: Voltage Regulators - Switching; RoHS: TRUE; Octopart: https://octopart.com/ap63203wu-7-diodes+inc.-98099550; Output Voltage: 3.3V; Lead Free: Yes; ComponentLink2URL: https://www.diodes.com/assets/Datasheets/AP63200-AP63201-AP63203-AP63205.pdf; Digikey Description: IC REG BUCK 3.3V 2A TSOT26; Footprint Url: https://www.diodes.com/assets/Package-Files/TSOT26.pdf; Ambient Temperature Range High: +85°C; Height: 1mm; Automotive: No; Temperature Range High: +160°C; Switching Topology: Buck; Output Current: 2A; Package: TSOT26; Category: IC; Mouser Description: AP63203 Series 3.3 V 2 A SMT Fixed Low IQ Synchronous Buck - TSOT-26; Device Class L2: Power Management ICs; Ambient Temperature Range Low: -40°C; Manufacturer Part Number: AP63203WU-7

## Sheet EEPROM.SchDoc
size A4; SheetNumber: 10; SheetTotal: 15
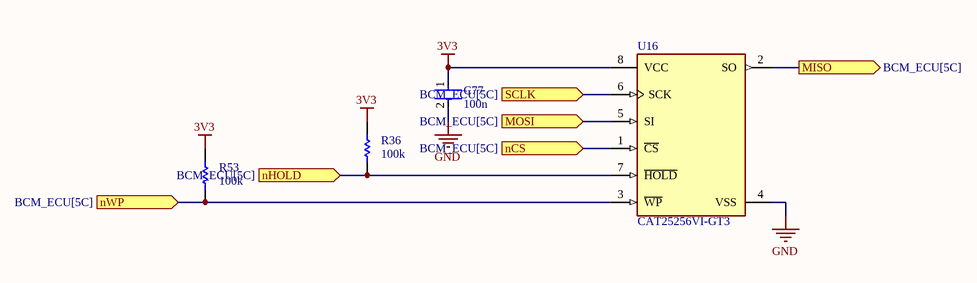
[diagram p13: EEPROM.SchDoc]

### Parts
C77  100n  [FP-0402-L_1_0_0_05-W_0_5-IPC_A]
R36  100k  [R0603B]
R53  100k  [R0603B]
U16  CAT25256VI-GT3  [FP-CAT25256VI-GT3-IPC_C]

### Ports
MISO (out, see BCM_ECU[5C]), MOSI (in, see BCM_ECU[5C]), nCS (in, see BCM_ECU[5C]), nHOLD (in, see BCM_ECU[5C]), nWP (in, see BCM_ECU[5C]), SCLK (in, see BCM_ECU[5C])

### Nets
3V3: C77.1 R36.2 R53.2 U16.8(VCC)
GND: C77.2 U16.4(VSS)
CAN_MISO: U16.2(SO) ; port MISO
CAN_MOSI: U16.5(SI) ; port MOSI
CAN_SCLK: U16.6(SCK) ; port SCLK
NetR36_1: R36.1 U16.7(~{HOLD}) ; port nHOLD
NetR53_1: R53.1 U16.3(~{WP}) ; port nWP
NetU10_7: U16.1(~{CS}) ; port nCS

### Library data of the parts
C77 = CMP-001-00058-1: as C52 on sheet BOOST_REG; Min Operating Temperature: -55°C; Mounting Technology: Surface Mount; Pins: 2; Case/Package: 0402; RoHS Compliant: Yes; Max Operating Temperature: 85°C
R36 R53 = CMP-009-00002-14: Resistor; Value: 10k
U16 = CMP-07117-000003-1: IC EEPROM 256K SPI 20MHZ 8SOIC; Manufacturer: ON Semiconductor; Max Supply Voltage: 5.5V; Standoff Height: 0.1mm; Memory Size: 256Kbits; Nominal Supply Current: 2-4mA; Min Supply Voltage: 1.8V; RoHS: TRUE; Temperature: -40°C to +85°C; Category: IC; Mouser Description: EEPROM Serial-SPI 256K-bit 32K x 8 2.5V/3.3V/5V 8-Pin SOIC N T/R; Lead Free: Yes; Ipc Land Pattern Name: SOIC127P600X155-8; ComponentLink2Description: Datasheet; Digikey Description: IC EEPROM 256K SPI 20MHZ 8SOIC; Memory Type: EEPROM; Manufacturer Part Number: CAT25256VI-GT3; Footprint Url: https://www.onsemi.com/pub/Collateral/751BD.PDF; Interface: SPI; Automotive: No; Device Class L2: Memory; Octopart: https://octopart.com/cat25256vi-gt3-on+semiconductor-10567745; ComponentLink2URL: https://www.onsemi.cn/PowerSolutions/document/CAT25256-D.PDF; Temperature Range Low: -40°C; Temperature Range High: +85°C; Device Class L3: EEPROM; Height: 1.75mm; Frequency: 20MHz; Package: SOIC8; Device Class L1: Integrated Circuits (ICs)

## Sheet PWR_PROT_REV.SchDoc
size A4; SheetNumber: 5; SheetTotal: 15
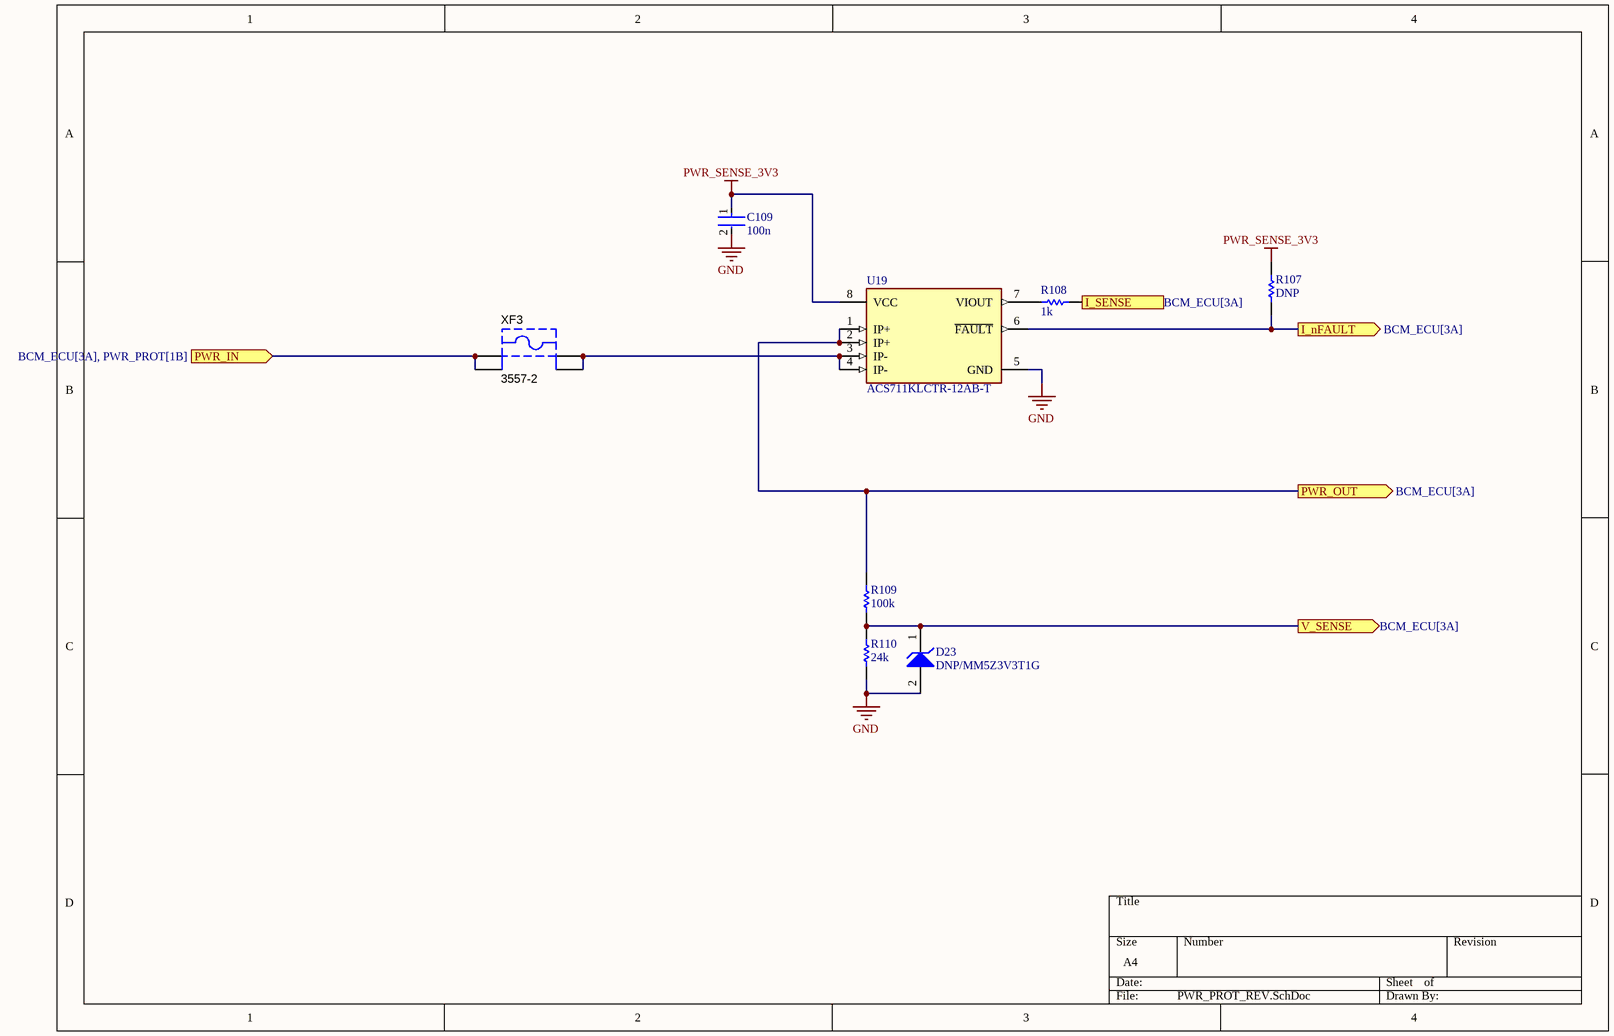
[diagram p14: PWR_PROT_REV.SchDoc]

### Parts
C109  100n  [FP-0402-L_1_0_0_05-W_0_5-IPC_A]
D23  DNP/MM5Z3V3T1G  [ONSC-SOD-523-2-502-01_V]
R107  DNP  [R0603B]
R108  1k  [R0603B]
R109  100k  [R0603B]
R110  24k  [R0603B]
U19  ACS711KLCTR-12AB-T  [FP-LC-8-IPC_C]
XF3  3557-2  [KSTN-3557-2]

### Ports
I_nFAULT (out, see BCM_ECU[3A]), I_SENSE (out, see BCM_ECU[3A]), PWR_IN (in, see BCM_ECU[3A], PWR_PROT[1B]), PWR_OUT (out, see BCM_ECU[3A]), V_SENSE (out, see BCM_ECU[3A])

### Nets
GND: C109.2 D23.2(A) R110.2 U19.5(GND)
PRE_BST_AMP_VCC: R109.1 U19.1(IP+) U19.2(IP+) ; port PWR_OUT
PWR_OUT: XF3.1 XF3.2 ; port PWR_IN
PWR_SENSE_3V3: C109.1 R107.1 U19.8(VCC)
AMP_I_SENSE: R108.1 ; port I_SENSE
AMP_V_SENSE: D23.1(K) R109.2 R110.1 ; port V_SENSE
NetR107_2: R107.2 U19.6(~{FAULT}) ; port I_nFAULT
NetR108_2: R108.2 U19.7(VIOUT)
NetU19_3: U19.3(IP-) U19.4(IP-) XF3.3 XF3.4

### Library data of the parts
C109 = CMP-001-00058-1: as C52 on sheet BOOST_REG; Min Operating Temperature: -55°C; Mounting Technology: Surface Mount; Pins: 2; Case/Package: 0402; RoHS Compliant: Yes; Max Operating Temperature: 85°C
D23 = CMP-1060-00750-1: as D46 on sheet INT_REG; RoHS: Pb-Free; ComponentLink2Description: Datasheet; PackageReference: SOD-523-2-502-01; DatasheetVersion: Rev. 10; ComponentLink1Description: Manufacturer URL; PackageVersion: Rev. E, 09/2010; ComponentLink3URL: http://www.onsemi.com/pub_link/Collateral/502-01.PDF; ComponentLink2URL: http://www.onsemi.cn/pub_link/Collateral/MM5Z2V4T1-D.PDF; Mounting Technology: Surface Mount; PartNumber: MM5Z3V3T1G; Packing: Tape and Reel; PackageDescription: 2-Pin SOD, Body 1.2 x 0.8 mm; ComponentLink1URL: http://www.onsemi.com/; ComponentLink3Description: Package Specification
R107 R109 = CMP-009-00002-14: Resistor; Value: 10k
R108 = CMP-009-00002-14: Resistor; Value: 1k
R110 = CMP-009-00002-14: Resistor; Value: 2.7k
U19 = CMP-1557-00012-2: as U15 on sheet BOOST_REG; Case/Package: SOIC; Packaging: Tape and Reel; Number of Pins: 8; Width: 3.9mm; Frequency: 100kHz; -3db Bandwidth: 100kHz; REACH SVHC: No SVHC; Series: -; Height: 1.5mm; Package Quantity: 1; Min Operating Temperature: -40°C; Max Operating Temperature: 125°C; Current Sensing: 12.5A; RoHS Compliant: Yes; Length: 4.9mm
XF3 = CMP-2000-05461-1: FUSE HOLDER, PCB MOUNT, 500VAC, 20A, ROHS; Manufacturer: Keystone-Electronics; Number of Circuits: 1; Voltage: 500V; Fuseholder Type: Block; Fuse Type: Blade; Fuse Size: 0.43"Lx0.15"Wx0.64"H(10.92mmx3.81mmx16.25mm); For Use With/Related Products: ATC,ATO257,MINI897; Current Rating: 30A; Datasheet URL: http://datasheet.octopart.com/3557-2-Keystone-datasheet-15715937.pdf; Orientation: Vertical; Family: Fuseholders; Datasheet Version: Apr-13; Contact Finish: TinNickel; Mounting Type: PCB; Series: -; Category: CircuitProtection; Termination Style: PCPin; Contact Material: Brass; Manufacturer URL: http://www.keyelco.com/

## Sheet PWR_PROT.SchDoc
size A4; SheetNumber: 13; SheetTotal: 15
Used 5 times, as channels PWR_PROT_1, PWR_PROT_2, PWR_PROT_3, PWR_PROT_4, PWR_PROT_5. Parts and nets are listed once, with the designators drawn on the sheet.
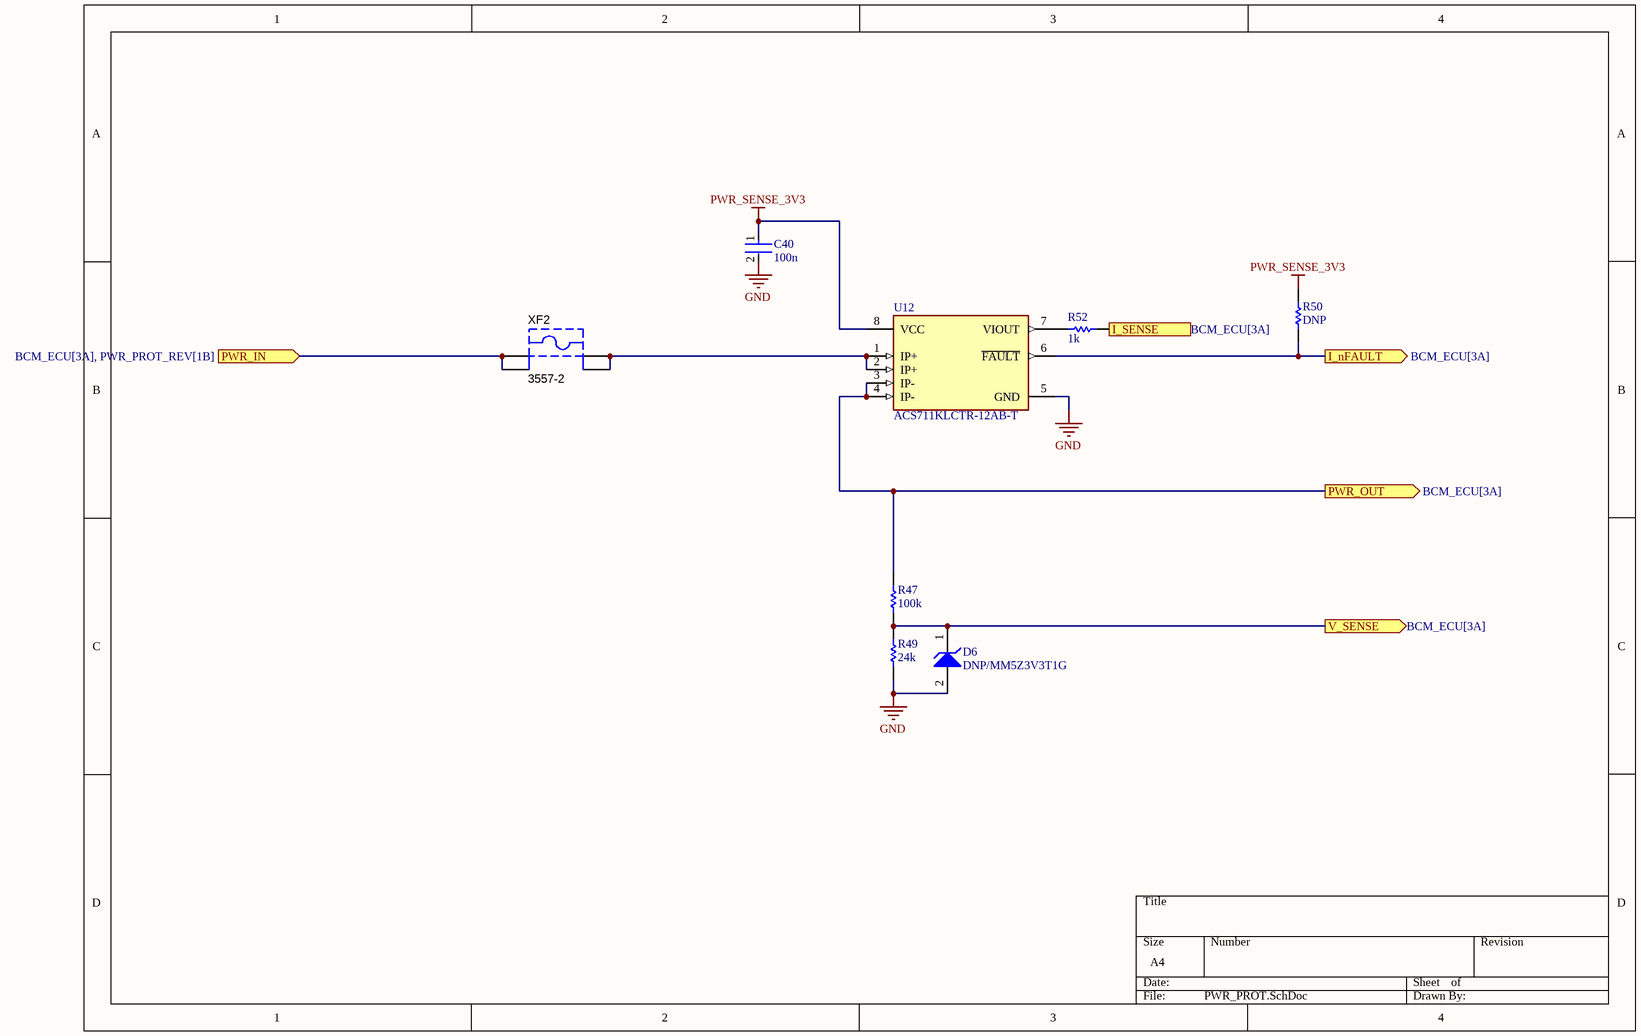
[diagram p15: PWR_PROT.SchDoc]

### Parts
C40  100n  [FP-0402-L_1_0_0_05-W_0_5-IPC_A]
D6  DNP/MM5Z3V3T1G  [ONSC-SOD-523-2-502-01_V]
R47  100k  [R0603B]
R49  24k  [R0603B]
R50  DNP  [R0603B]
R52  1k  [R0603B]
U12  ACS711KLCTR-12AB-T  [FP-LC-8-IPC_C]
XF2  3557-2  [KSTN-3557-2]

### Ports
I_nFAULT (out, see BCM_ECU[3A]), I_SENSE (out, see BCM_ECU[3A]), PWR_IN (in, see BCM_ECU[3A], PWR_PROT_REV[1B]), PWR_OUT (out, see BCM_ECU[3A]), V_SENSE (out, see BCM_ECU[3A])

### Nets
GND: C40.2 D6.2(A) R49.2 U12.5(GND)
PWR_SENSE_3V3: C40.1 R50.1 U12.8(VCC)
I_nFAULT: R50.2 U12.6(~{FAULT}) ; port I_nFAULT
I_SENSE: R52.1 ; port I_SENSE
PWR_IN: XF2.1 XF2.2 ; port PWR_IN
PWR_OUT: R47.1 U12.3(IP-) U12.4(IP-) ; port PWR_OUT
V_SENSE: D6.1(K) R47.2 R49.1 ; port V_SENSE
NetR52_2: R52.2 U12.7(VIOUT)
NetU12_1: U12.1(IP+) U12.2(IP+) XF2.3 XF2.4

### Channels
PWR_PROT_1: designators end in _PWR_PROT_1; ports I_nFAULT=NetR50_PWR_PROT_1_2 I_SENSE=BCM_I_SENSE PWR_IN=PWR_OUT PWR_OUT=BCM_VCC V_SENSE=BCM_V_SENSE
PWR_PROT_2: designators end in _PWR_PROT_2; ports I_nFAULT=NetR50_PWR_PROT_2_2 I_SENSE=LED_A_I_SENSE PWR_IN=PWR_OUT PWR_OUT=LED_A V_SENSE=LED_A_V_SENSE
PWR_PROT_3: designators end in _PWR_PROT_3; ports I_nFAULT=NetR50_PWR_PROT_3_2 I_SENSE=LED_B_I_SENSE PWR_IN=PWR_OUT PWR_OUT=LED_B V_SENSE=LED_B_V_SENSE
PWR_PROT_4: designators end in _PWR_PROT_4; ports I_nFAULT=NetR50_PWR_PROT_4_2 I_SENSE=LED_C_I_SENSE PWR_IN=PWR_OUT PWR_OUT=LED_C V_SENSE=LED_C_V_SENSE
PWR_PROT_5: designators end in _PWR_PROT_5; ports I_nFAULT=NetR50_PWR_PROT_5_2 I_SENSE=LED_D_I_SENSE PWR_IN=PWR_OUT PWR_OUT=LED_D V_SENSE=LED_D_V_SENSE

### Library data of the parts
C40 = CMP-001-00058-1: as C52 on sheet BOOST_REG; Min Operating Temperature: -55°C; Mounting Technology: Surface Mount; Pins: 2; Case/Package: 0402; RoHS Compliant: Yes; Max Operating Temperature: 85°C
D6 = CMP-1060-00750-1: as D46 on sheet INT_REG; RoHS: Pb-Free; ComponentLink2Description: Datasheet; PackageReference: SOD-523-2-502-01; DatasheetVersion: Rev. 10; ComponentLink1Description: Manufacturer URL; PackageVersion: Rev. E, 09/2010; ComponentLink3URL: http://www.onsemi.com/pub_link/Collateral/502-01.PDF; ComponentLink2URL: http://www.onsemi.cn/pub_link/Collateral/MM5Z2V4T1-D.PDF; Mounting Technology: Surface Mount; PartNumber: MM5Z3V3T1G; Packing: Tape and Reel; PackageDescription: 2-Pin SOD, Body 1.2 x 0.8 mm; ComponentLink1URL: http://www.onsemi.com/; ComponentLink3Description: Package Specification
R47 R50 = CMP-009-00002-14: Resistor; Value: 10k
R49 = CMP-009-00002-14: Resistor; Value: 2.7k
R52 = CMP-009-00002-14: Resistor; Value: 1k
U12 = CMP-1557-00012-2: as U15 on sheet BOOST_REG; Case/Package: SOIC; Packaging: Tape and Reel; Number of Pins: 8; Width: 3.9mm; Frequency: 100kHz; -3db Bandwidth: 100kHz; REACH SVHC: No SVHC; Series: -; Height: 1.5mm; Package Quantity: 1; Min Operating Temperature: -40°C; Max Operating Temperature: 125°C; Current Sensing: 12.5A; RoHS Compliant: Yes; Length: 4.9mm
XF2 = CMP-2000-05461-1: as XF3 on sheet PWR_PROT_REV; Datasheet URL: http://datasheet.octopart.com/3557-2-Keystone-datasheet-15715937.pdf; Orientation: Vertical; Family: Fuseholders; Datasheet Version: Apr-13; Contact Finish: TinNickel; Mounting Type: PCB; Series: -; Category: CircuitProtection; Termination Style: PCPin; Contact Material: Brass; Manufacturer URL: http://www.keyelco.com/